# EasyEDA Pro project ProPrj_egg_2025-03-07.epro

# Schematic 功能图

## Sheets
1 P1: Board Name: Board1; Create Date: 2025-02-22; Page Name: P1; Project Name: egg; Schematic Name: 功能图; Update Date: 2025-03-04; Company: 嘉立创EDA; Page Size: A4; Version: V1.0
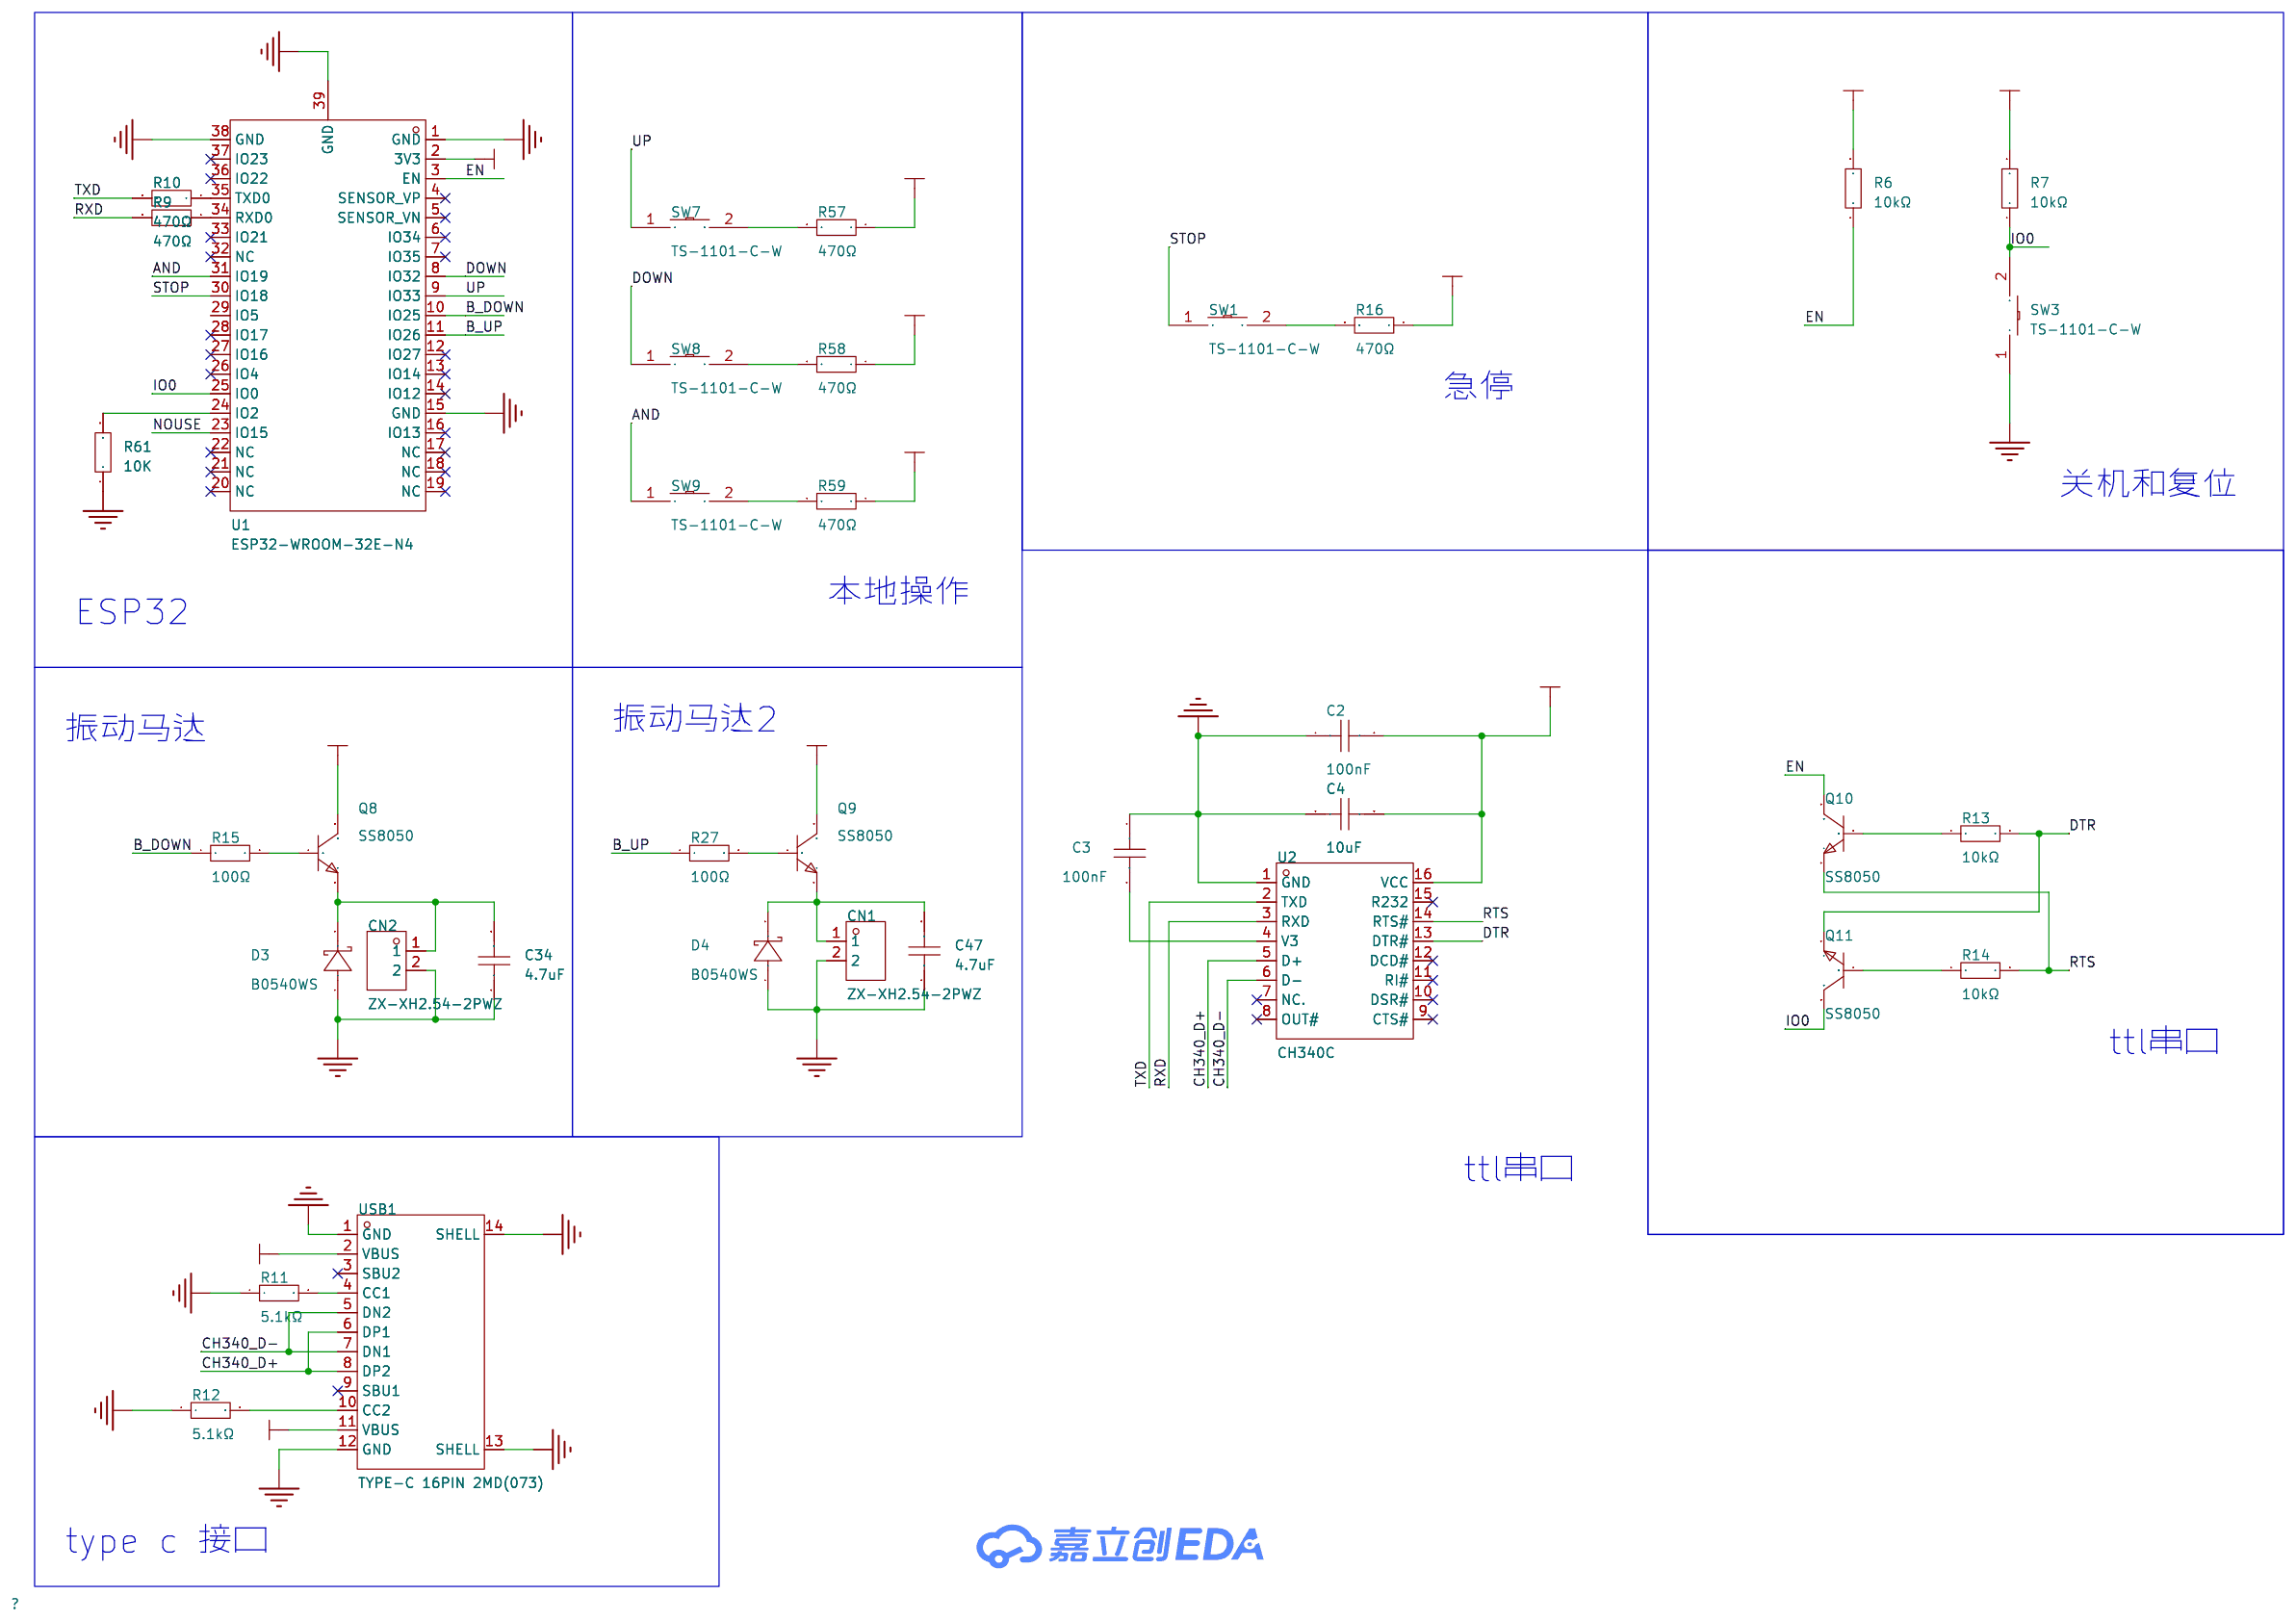
[diagram p0: P1]
2 P2: Create Date: 2025-02-26; Page Name: P2; Update Date: 2025-03-03
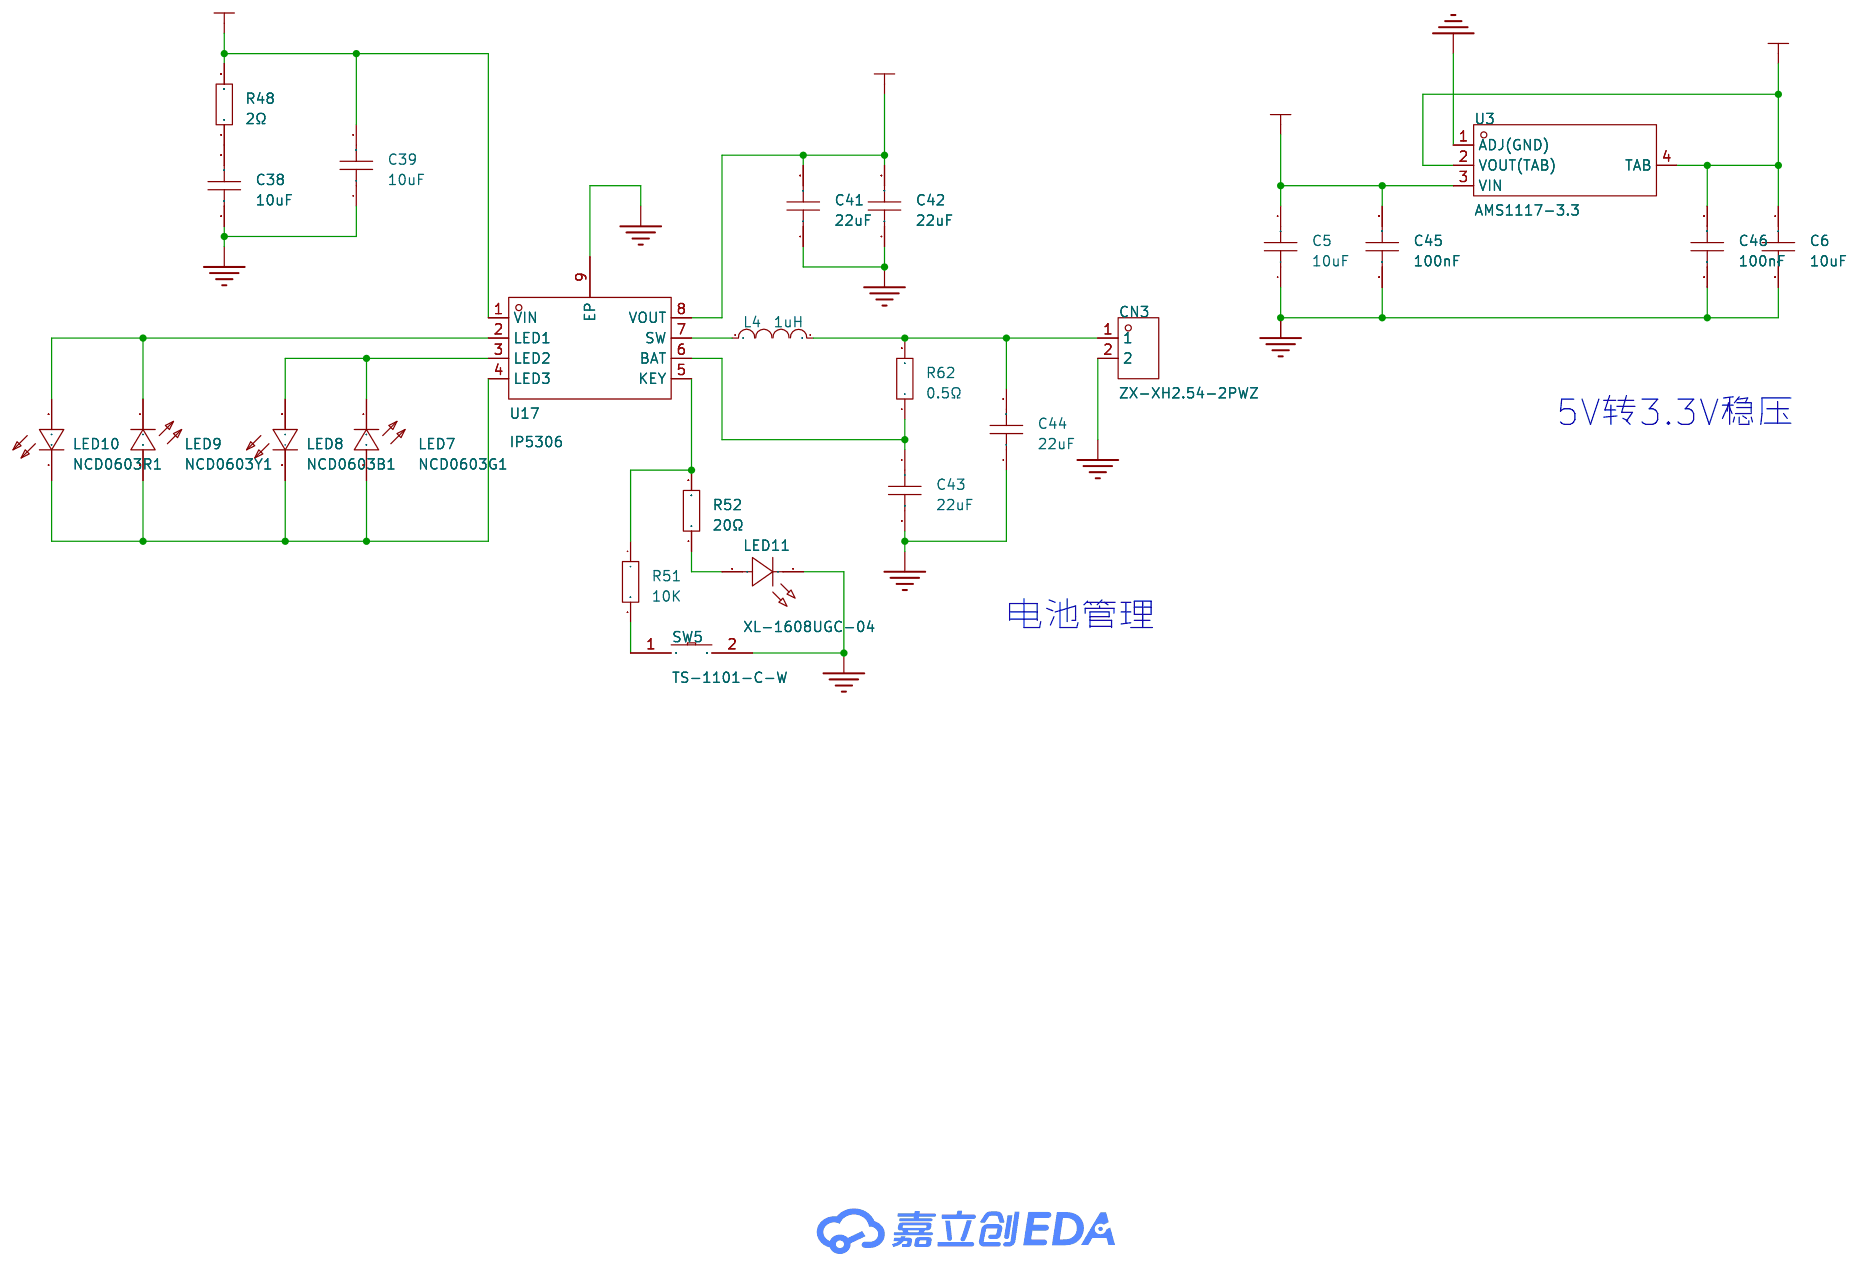
[diagram p1: P2]

## Parts
sheet P1
C2  100nF  [C0603]
C3  100nF  [C0603]
C4  10uF  [C0603]
C34  4.7uF  [C0603]
C47  4.7uF  [C0603]
CN1  ZX-XH2.54-2PWZ  [CONN-TH_2P-P2.50_ZX-XH2.54-2PWZ]
CN2  ZX-XH2.54-2PWZ  [CONN-TH_2P-P2.50_ZX-XH2.54-2PWZ]
D3  B0540WS  [SOD-323_L1.7-W1.3-LS2.5-FD]
D4  B0540WS  [SOD-323_L1.7-W1.3-LS2.5-FD]
Q8  SS8050  [SOT-23-3_L2.9-W1.3-P1.90-LS2.4-BR]
Q9  SS8050  [SOT-23-3_L2.9-W1.3-P1.90-LS2.4-BR]
Q10  SS8050  [SOT-23-3_L2.9-W1.3-P1.90-LS2.4-BR]
Q11  SS8050  [SOT-23-3_L2.9-W1.3-P1.90-LS2.4-BR]
R6  10kΩ  [R0603]
R7  10kΩ  [R0603]
R9  470Ω  [R0603]
R10  470Ω  [R0603]
R11  5.1kΩ  [R0603]
R12  5.1kΩ  [R0603]
R13  10kΩ  [R0603]
R14  10kΩ  [R0603]
R15  100Ω  [R0603]
R16  470Ω  [R0603]
R27  100Ω  [R0603]
R57  470Ω  [R0603]
R58  470Ω  [R0603]
R59  470Ω  [R0603]
R61  10K  [R0603]
SW1  TS-1101-C-W  [SW-SMD_L6.0-W3.3-LS8.0]
SW3  TS-1101-C-W  [SW-SMD_L6.0-W3.3-LS8.0]
SW7  TS-1101-C-W  [SW-SMD_L6.0-W3.3-LS8.0]
SW8  TS-1101-C-W  [SW-SMD_L6.0-W3.3-LS8.0]
SW9  TS-1101-C-W  [SW-SMD_L6.0-W3.3-LS8.0]
U1  ESP32-WROOM-32E-N4  [WIFI-SMD_ESP32-WROOM-32E]
U2  CH340C  [SOP-16_L10.0-W3.9-P1.27-LS6.0-BL]
USB1  TYPE-C 16PIN 2MD(073)  [USB-C-SMD_TYPE-C-6PIN-2MD-073]
sheet P2
C5  10uF  [C0603]
C6  10uF  [C0603]
C38  10uF  [C0603]
C39  10uF  [C0603]
C41  22uF  [C0603]
C42  22uF  [C0603]
C43  22uF  [C0603]
C44  22uF  [C0603]
C45  100nF  [C0603]
C46  100nF  [C0603]
CN3  ZX-XH2.54-2PWZ  [CONN-TH_2P-P2.50_ZX-XH2.54-2PWZ]
L4  1uH  [L0603]
LED7  NCD0603G1  [LED0603-RD_1]
LED8  NCD0603B1  [LED0603-RD]
LED9  NCD0603Y1  [LED0603-RD]
LED10  NCD0603R1  [LED0603-RD_RED]
LED11  XL-1608UGC-04  [LED0603-RD_GREEN]
R48  2Ω  [R0603]
R51  10K  [R0603]
R52  20Ω  [R0603]
R62  0.5Ω  [R0603]
SW5  TS-1101-C-W  [SW-SMD_L6.0-W3.3-LS8.0]
U3  AMS1117-3.3  [SOT-223-4_L6.5-W3.5-P2.30-LS7.0-BR]
U17  IP5306  [ESOP-8_L4.9-W3.9-P1.27-LS6.0-BL-EP]

## Library data of the parts
C2 C3 = CGA0603X7R104K500JT: 容值:100nF;精度:±10%;额定电压:50V;材质(温度系数):X7R;; LCSC Part Name: 100nF ±10% 50V; Supplier Part: C6119867; Manufacturer: HRE(芯声); Supplier Footprint: 0603; JLCPCB Part Class: 扩展库; Supplier: LCSC; Tolerance: ±10%; Voltage Rated: 50V; Temperature Coefficient: X7R
C4-C6 = CGA0603X5R106K100JT: 容值:10uF;精度:±10%;额定电压:10V;材质(温度系数):X5R;; LCSC Part Name: 10uF ±10% 10V; Supplier Part: C6119842; Manufacturer: HRE(芯声); Supplier Footprint: 0603; JLCPCB Part Class: 扩展库; Supplier: LCSC; Tolerance: ±10%; Voltage Rated: 10V; Temperature Coefficient: X5R
C34 C38 C39 C41-C47 = CAP_0603: Supplier Footprint: 0603
CN1-CN3 = ZX-XH2.54-2PWZ: 插针结构:1x2P;间距:2.5mm;安装方式:弯插;参考系列:XH;总PIN数:2P;排数:1;每排PIN数:2;行距:-;额定电流:3A;触头材质:黄铜;触头镀层:锡;工作温度范围:-25℃~+85℃;; LCSC Part Name: 1x2P 间距:2.5mm 弯插 系列:XH; Supplier Part: C7429641; Manufacturer: Megastar(兆星); Supplier Footprint: 弯插,P=2.5mm; JLCPCB Part Class: 扩展库; Datasheet: https://atta.szlcsc.com/upload/public/pdf/source/20230619/56AE8F2E01CDFEAA97FC89B5ED558AB5.pdf; Supplier: LCSC; Pins Structure: 1x2P; Pitch: 2.5mm; Mounting Type: 弯插; Reference Series: XH; Number of Pins: 2P; Number of Rows: 1; Number of PINs Per Row: 2; Rated Current: 3A; Contact Material: 黄铜; Contact Plating: 锡; Operating Temperature: -25℃~+85℃; Rated Voltage (Max): 250V; Plastic Material: PA66; Flame Retardant Rating: UL94V-0; Color: 白色; Z-Height of the Board: 5.9mm; X-Length of Bottom Edge on Board (Spacing Line): 7.5mm; Y-Width of Bottom Edge on Board: 7.32mm
D3 D4 = B0540WS_C7420326: 二极管配置:独立式;正向压降(Vf):510mV@500mA;直流反向耐压(Vr):40V;整流电流:500mA;; LCSC Part Name: 电压:40V 电流:500mA; Supplier Part: C7420326; Manufacturer: 宏迦橙; Supplier Footprint: SOD-323; JLCPCB Part Class: 扩展库; Datasheet: https://atta.szlcsc.com/upload/public/pdf/source/20230828/D03BBC301FC735629C9CE389FB922DA4.pdf; Supplier: LCSC; Diode Configuration: 独立式; Forward Voltage (Vf@If): 510mV@500mA; Reverse Voltage (Vr): 40V; Rectified Current: 500mA; Reverse Leakage Current (Ir): 20uA@40V
Q8-Q11 = SS8050_C7420370: 晶体管类型:NPN;集电极电流(Ic):1.5A;集射极击穿电压(Vceo):25V;耗散功率(Pd):300mW;直流电流增益(hFE):120@100mA,1.0V;; LCSC Part Name: H档 200-350; Supplier Part: C7420370; Manufacturer: 宏嘉诚; Supplier Footprint: SOT-23; JLCPCB Part Class: 扩展库; Datasheet: https://atta.szlcsc.com/upload/public/pdf/source/20250205/5DB94E86981B5B1A1866D18E379C0D4F.pdf; Supplier: LCSC; type: NPN; Current - Collector(Ic): 1.5A; Collector - Emitter Voltage VCEO: 25V; Pd - Power Dissipation: 300mW; DC Current Gain: 120@100mA,1.0V; Transition frequency(fT): 100MHz; Current - Collector Cutoff: 100nA; Vce Saturation(VCE(sat)): 500mV; Operating Temperature: -55℃~+150℃
R6 R7 R11-R14 = 0603WAF1002T5E: 电阻类型:厚膜电阻;阻值:10kΩ;精度:±1%;功率:100mW;最大工作电压:75V;温度系数:±100ppm/℃;; LCSC Part Name: 厚膜电阻 10kΩ ±1% 100mW; Supplier Part: C25804; Manufacturer: UNI-ROYAL(厚声); Supplier Footprint: 0603; JLCPCB Part Class: 基础库; Datasheet: https://atta.szlcsc.com/upload/public/pdf/source/20200306/C422600_1E6D84923E4A46A82E41ADD87F860B5C.pdf; Supplier: LCSC; Type: 厚膜电阻; Tolerance: ±1%; Power(Watts): 100mW; Overload Voltage (Max): 75V; Temperature Coefficient: ±100ppm/℃; Operating Temperature Range: -55℃~+155℃
R9 R10 R16 R57-R59 = 0603WAF4700T5E: 电阻类型:厚膜电阻;阻值:470Ω;精度:±1%;功率:100mW;最大工作电压:75V;温度系数:±100ppm/℃;; LCSC Part Name: 470Ω ±1% 100mW 厚膜电阻; Supplier Part: C23179; Manufacturer: UNI-ROYAL(厚声); Supplier Footprint: 0603; JLCPCB Part Class: 基础库; Datasheet: https://atta.szlcsc.com/upload/public/pdf/source/20200306/C422600_1E6D84923E4A46A82E41ADD87F860B5C.pdf; Supplier: LCSC; Type: 厚膜电阻; Tolerance: ±1%; Power(Watts): 100mW; Overload Voltage (Max): 75V; Temperature Coefficient: ±100ppm/℃; Operating Temperature Range: -55℃~+155℃
R15 R27 R48 R51 R52 R61 R62 = Res_0603: Supplier Footprint: 0603
SW1 SW3 SW5 SW7-SW9 = TS-1101-C-W: 电路结构:单刀单掷;按钮形状:矩形按钮;作用力:260gf;安装方式:立贴;开关长度:6mm;开关宽度:3.6mm;开关高度:2.5mm;带支架:不带;触点电流:50mA;额定电压(AC):-;额定电压(DC):12V;额定功率:-;绝缘电阻:-;带灯:无;机械寿命:5万次;; LCSC Part Name: 6*3.6*2.5mm 立贴 轻触开关; Supplier Part: C318938; Manufacturer: XKB Connectivity(中国星坤); Supplier Footprint: SMD; JLCPCB Part Class: 扩展库; Datasheet: https://atta.szlcsc.com/upload/public/pdf/source/20200227/C318938_C2E53B1EEDE37D980A33616AC086DE53.pdf; Supplier: LCSC; Circuit: 单刀单掷; Actuator Style: 矩形按钮; Operating Force: 260gf; Mounting Style: 立贴; Switch Length: 6mm; Switch Width: 3.6mm; Switch Height: 2.5mm; Strike Gundam: 不带; Contact Current: 50mA; Voltage Rating (DC): 12V; Actuator/Cap Color: 白色带淡绿; With Lamp: 无; Mechanical Life: 5万次; Operating Temperature: -30℃~+85℃
U1 = ESP32-WROOM-32E-N4: ESP32-WROOM-32E 集成 ESP32-D0WD-V3 芯片，具有高的稳定性和安全性能。; LCSC Part Name: 通用型Wi-Fi+BT+BLE MCU模组; Supplier Part: C701341; Manufacturer: ESPRESSIF(乐鑫); Supplier Footprint: SMD,18x25.5mm; JLCPCB Part Class: 扩展库; Datasheet: https://atta.szlcsc.com/upload/public/pdf/source/20220601/0020821B65DE5740BBACA5FACC5CF3B6.pdf; Supplier: LCSC
U2 = CH340C: 应用功能:收发器;接口协议:USB 2.0;数据速率:2Mbps;; LCSC Part Name: CH340C USB转串口芯片 CH340; Supplier Part: C84681; Manufacturer: WCH(南京沁恒); Supplier Footprint: SOP-16; JLCPCB Part Class: 扩展库; Datasheet: https://atta.szlcsc.com/upload/public/pdf/source/20240619/63986D8440D4E5267A77ACD891CC4DE3.pdf; Supplier: LCSC; Applications Function: 收发器; Protocol: USB 2.0; Supply Voltage: 3.3V；5V; Data Rate: 2Mbps
USB1 = TYPE-C 16PIN 2MD(073): 连接器类型:Type-C;标准:USB 3.1;公母:母;安装方式:卧贴;触点数量:16P;端口数量:1;额定电流 - 电源:5A;工作温度范围:-25℃~+85℃;; LCSC Part Name: Type-C 母 卧贴; Supplier Part: C2765186; Manufacturer: SHOU HAN(首韩); Supplier Footprint: SMD; JLCPCB Part Class: 扩展库; Datasheet: https://atta.szlcsc.com/upload/public/pdf/source/20211123/39B17C16241EAC15C5E277BDA434118E.pdf; Supplier: LCSC; Connector Type: Type-C; Standard: USB 3.1; Gender: 母; Mounting Style: 卧贴; Number of Contacts: 16P; Number of Ports: 1; Current Rating - Power (Max): 5A; Operating Temperature Range: -25℃~+85℃; Rated Voltage (Max): 5V; Connect-Disconnect Life: 5千次; Core Colour: 黑色
L4 = L_0603
LED7 = NCD0603G1: 发光颜色:翠绿色;正向电压(VF):2.6V~3.6V;功率:72mW;正向电流:10mA;主波长:515nm~530nm;透镜颜色:无色透明透镜;发光强度:330mcd~900mcd;发光角度:130°;工作温度:-30℃~+85℃;; Supplier Part: C84267; Manufacturer: 国星光电; Supplier Footprint: 0603; JLCPCB Part Class: 扩展库; Datasheet: https://atta.szlcsc.com/upload/public/pdf/source/20200820/C84267_04BA7703640BAC111D09F5EFB971FBF3.pdf; Supplier: LCSC; Emitted Color: 翠绿色; Forward Voltage (VF): 2.6V~3.6V; Power Dissipation: 72mW; Forward Current: 10mA; Dominant Wavelength: 515nm~530nm; Lens Color: 无色透明透镜; Luminous Intensity: 330mcd~900mcd; Viewing Angle: 130°; Operating Temperature: -30℃~+85℃
LED8 = NCD0603B1: 发光颜色:蓝色;正向电压(VF):2.6V~3.6V;功率:72mW;正向电流:10mA;主波长:463nm~475nm;透镜颜色:无色透明透镜;发光强度:80mcd~220mcd;发光角度:130°;工作温度:-30℃~+85℃;; Supplier Part: C84266; Manufacturer: 国星光电; Supplier Footprint: 0603; JLCPCB Part Class: 扩展库; Datasheet: https://atta.szlcsc.com/upload/public/pdf/source/20200820/C84266_6A3CDBEFA72C6CAD68EDA53474ADAE6C.pdf; Supplier: LCSC; Emitted Color: 蓝色; Forward Voltage (VF): 2.6V~3.6V; Power Dissipation: 72mW; Forward Current: 10mA; Dominant Wavelength: 463nm~475nm; Lens Color: 无色透明透镜; Luminous Intensity: 80mcd~220mcd; Viewing Angle: 130°; Operating Temperature: -30℃~+85℃
LED9 = NCD0603Y1: 发光颜色:黄色;正向电压(VF):1.6V~2.6V;功率:65mW;正向电流:20mA;主波长:586nm~595nm;透镜颜色:无色透明透镜;发光强度:80mcd~220mcd;发光角度:130°;工作温度:-30℃~+85℃;; Supplier Part: C84268; Manufacturer: 国星光电; Supplier Footprint: 0603; JLCPCB Part Class: 扩展库; Datasheet: https://atta.szlcsc.com/upload/public/pdf/source/20200820/C84268_8FC106CB292CF978F9CFC6892464F83C.pdf; Supplier: LCSC; Emitted Color: 黄色; Forward Voltage (VF): 1.6V~2.6V; Power Dissipation: 65mW; Forward Current: 20mA; Dominant Wavelength: 586nm~595nm; Lens Color: 无色透明透镜; Luminous Intensity: 80mcd~220mcd; Viewing Angle: 130°; Operating Temperature: -30℃~+85℃
LED10 = NCD0603R1_C84263: 灯头类型:-;发光颜色:红色;正向电压(VF):1.6V~2.6V;功率:65mW;正向电流:20mA;主波长:615nm~630nm;二极管配置:独立二极管;透镜颜色:无色透明透镜;色温:-;发光强度:80mcd~220mcd;发光角度:130°;载带方式:-;工作温度:-30℃~+85℃;; Supplier Part: C84263; Manufacturer: 国星光电; Supplier Footprint: 0603; JLCPCB Part Class: 扩展库; Datasheet: https://atta.szlcsc.com/upload/public/pdf/source/20200820/C84263_DABC6A75E58F576973B407FDBA283D60.pdf; Supplier: LCSC; Emitted Color: 红色; Forward Voltage (VF): 1.6V~2.6V; Power Dissipation: 65mW; Forward Current: 20mA; Dominant Wavelength: 615nm~630nm; Diode Configuration: 独立二极管; Lens Color: 无色透明透镜; Luminous Intensity: 80mcd~220mcd; Viewing Angle: 130°; Operating Temperature: -30℃~+85℃
LED11 = XL-1608UGC-04: 灯头类型:-;发光颜色:翠绿色;正向电压(VF):-;功率:80mW;正向电流:25mA;主波长:516nm~525nm;二极管配置:独立二极管;透镜颜色:无色透明透镜;色温:-;发光强度:-;发光角度:120°;载带方式:正贴;工作温度:-30℃~+85℃;; Supplier Part: C965804; Manufacturer: XINGLIGHT(成兴光); Supplier Footprint: 0603; JLCPCB Part Class: 扩展库; Datasheet: https://atta.szlcsc.com/upload/public/pdf/source/20221102/520D6E465E5CFD1609C8A4DBC80D4018.pdf; Supplier: LCSC; Emitted Color: 翠绿色; Power Dissipation: 80mW; Forward Current: 25mA; Dominant Wavelength: 516nm~525nm; Peak Wavelength: 534nm; Diode Configuration: 独立二极管; Lens Color: 无色透明透镜; Viewing Angle: 120°; Mounting Sytle: 正贴; Operating Temperature: -30℃~+85℃
U3 = AMS1117-3.3_C347222: 输出类型:固定;工作电压:12V;输出电压:3.3V;输出电流:1A;电源纹波抑制比(PSRR):60dB@(120Hz);输出极性:正极;; LCSC Part Name: 输出:3.3V 电流:1A 耐压:12V; Supplier Part: C347222; Manufacturer: UMW(友台半导体); Supplier Footprint: SOT-223; JLCPCB Part Class: 扩展库; Datasheet: https://atta.szlcsc.com/upload/public/pdf/source/20241218/BAF0263FA2E44BCD8AF41AA4FA04EFAA.pdf; Supplier: LCSC; Output Type: 固定; Maximum Input Voltage: 12V; Output Voltage: 3.3V; Output Current: 1A; Power Supply Rejection Ratio (PSRR): 60dB@(120Hz); Dropout Voltage: 1.3V@(1A); Feature: 过流保护(OCP); Output Polarity: 正极; Number of Outputs: 1
U17 = IP5306: 2.1A充电2.4A放电高集成度移动电源SOC; Supplier Part: C181692; Manufacturer: INJOINIC(英集芯); Supplier Footprint: ESOP-8; JLCPCB Part Class: 扩展库; Datasheet: https://atta.szlcsc.com/upload/public/pdf/source/20190627/C384572_9925B3DDC4041BC6108E5AB46A2A0AB1.pdf; Supplier: LCSC

## Nets
3.3V: C6.1 C46.2 Q9.3(C) R6.2 R7.2 R16.1 R57.1 R58.1 R59.1 U1.2(3V3) U3.2(VOUT(TAB)) U3.4(TAB)
5V: C5.2 C41.2 C42.2 C45.2 Q8.3(C) U3.3(VIN) U17.8(VOUT)
GND: C2.1 C3.1 C4.1 C5.1 C6.2 C34.1 C38.1 C39.1 C41.1 C42.1 C43.2 C44.1 C45.1 C46.1 C47.1 CN1.2 CN2.2 CN3.2 D3.1(A) D4.1(A) LED11.1(K) R11.1 R12.1 R61.1 SW3.1 SW5.2 U1.1(GND) U1.15(GND) U1.38(GND) U1.39(GND) U2.1(GND) U3.1(ADJ(GND)) U17.9(EP) USB1.1(GND) USB1.12(GND) USB1.13(SHELL) USB1.14(SHELL)
VBUS: C2.2 C4.2 C39.2 R48.2 U2.16(VCC) U17.1(VIN) USB1.2(VBUS) USB1.11(VBUS)
AND: SW9.1 U1.31(IO19)
B_DOWN: R15.1 U1.10(IO25)
B_UP: R27.1 U1.11(IO26)
CH340_D+: U2.5(D+) USB1.6(DP1) USB1.8(DP2)
CH340_D-: U2.6(D-) USB1.5(DN2) USB1.7(DN1)
DOWN: SW8.1 U1.8(IO32)
DTR: Q11.2(E) R13.2 U2.13(DTR#)
EN: Q10.3(C) R6.1 U1.3(EN)
IO0: Q11.3(C) R7.1 SW3.2 U1.25(IO0)
NOUSE: U1.23(IO15)
RTS: Q10.2(E) R14.2 U2.14(RTS#)
RXD: R9.2 U2.3(RXD)
STOP: SW1.1 U1.30(IO18)
TXD: R10.2 U2.2(TXD)
UP: SW7.1 U1.9(IO33)
$1N2030: R10.1 U1.35(TXD0)
$1N2036: R9.1 U1.34(RXD0)
$1N2231: C3.2 U2.4(V3)
$1N2993: R11.2 USB1.4(CC1)
$1N3161: R12.2 USB1.10(CC2)
$1N3457: Q10.1(B) R13.1
$1N3461: Q11.1(B) R14.1
$1N3836: Q8.1(B) R15.2
$1N4056: R16.2 SW1.2
$1N5469: Q9.1(B) R27.2
$1N5472: C47.2 CN1.1 D4.2(K) Q9.2(E)
$1N8409: R57.2 SW7.2
$1N8413: R58.2 SW8.2
$1N8417: R59.2 SW9.2
$1N8861: R61.2 U1.24(IO2)
$1N9302: C34.2 CN2.1 D3.2(K) Q8.2(E)
$2N7089: C38.2 R48.1
$2N7648: L4.1 U17.7(SW)
$2N7999: R51.1 R52.2 U17.5(KEY)
$2N8119: R51.2 SW5.1
$2N8284: LED11.2(A) R52.1
$2N8838: C43.1 R62.1 U17.6(BAT)
$2N8868: C44.2 CN3.1 L4.2 R62.2
$2N9076: LED7.2(A) LED8.1(-) LED9.2(A) LED10.1(K) U17.4(LED3)
$2N9082: LED7.1(K) LED8.2(+) U17.3(LED2)
$2N9123: LED9.1(K) LED10.2(A) U17.2(LED1)

Not connected (* = marked no-connect by the designer): U1 4(SENSOR_VP)* 5(SENSOR_VN)* 6(IO34)* 7(IO35)* 12(IO27)* 13(IO14)* 14(IO12)* 16(IO13)* 17(NC)* 18(NC)* 19(NC)* 20(NC)* 21(NC)* 22(NC)* 26(IO4)* 27(IO16)* 28(IO17)* 29(IO5) 32(NC)* 33(IO21)* 36(IO22)* 37(IO23)*; U2 7(NC.)* 8(OUT#)* 9(CTS#)* 10(DSR#)* 11(RI#)* 12(DCD#)* 15(R232)*; USB1 3(SBU2)* 9(SBU1)*

## Notes on the sheets
sheet 1
- 急停
- 关机和复位
- 本地操作
- ESP32
- 振动马达2
- 振动马达
- ttl串口
- ttl串口
- type c 接口
sheet 2
- 5V转3.3V稳压
- 电池管理

# Schematic 连接图

## Sheets
1 P1: Create Date: 2025-03-02; Page Name: P1; Project Name: egg; Schematic Name: 连接图; Update Date: 2025-03-03; Company: 嘉立创EDA; Page Size: A4; Version: V1.0
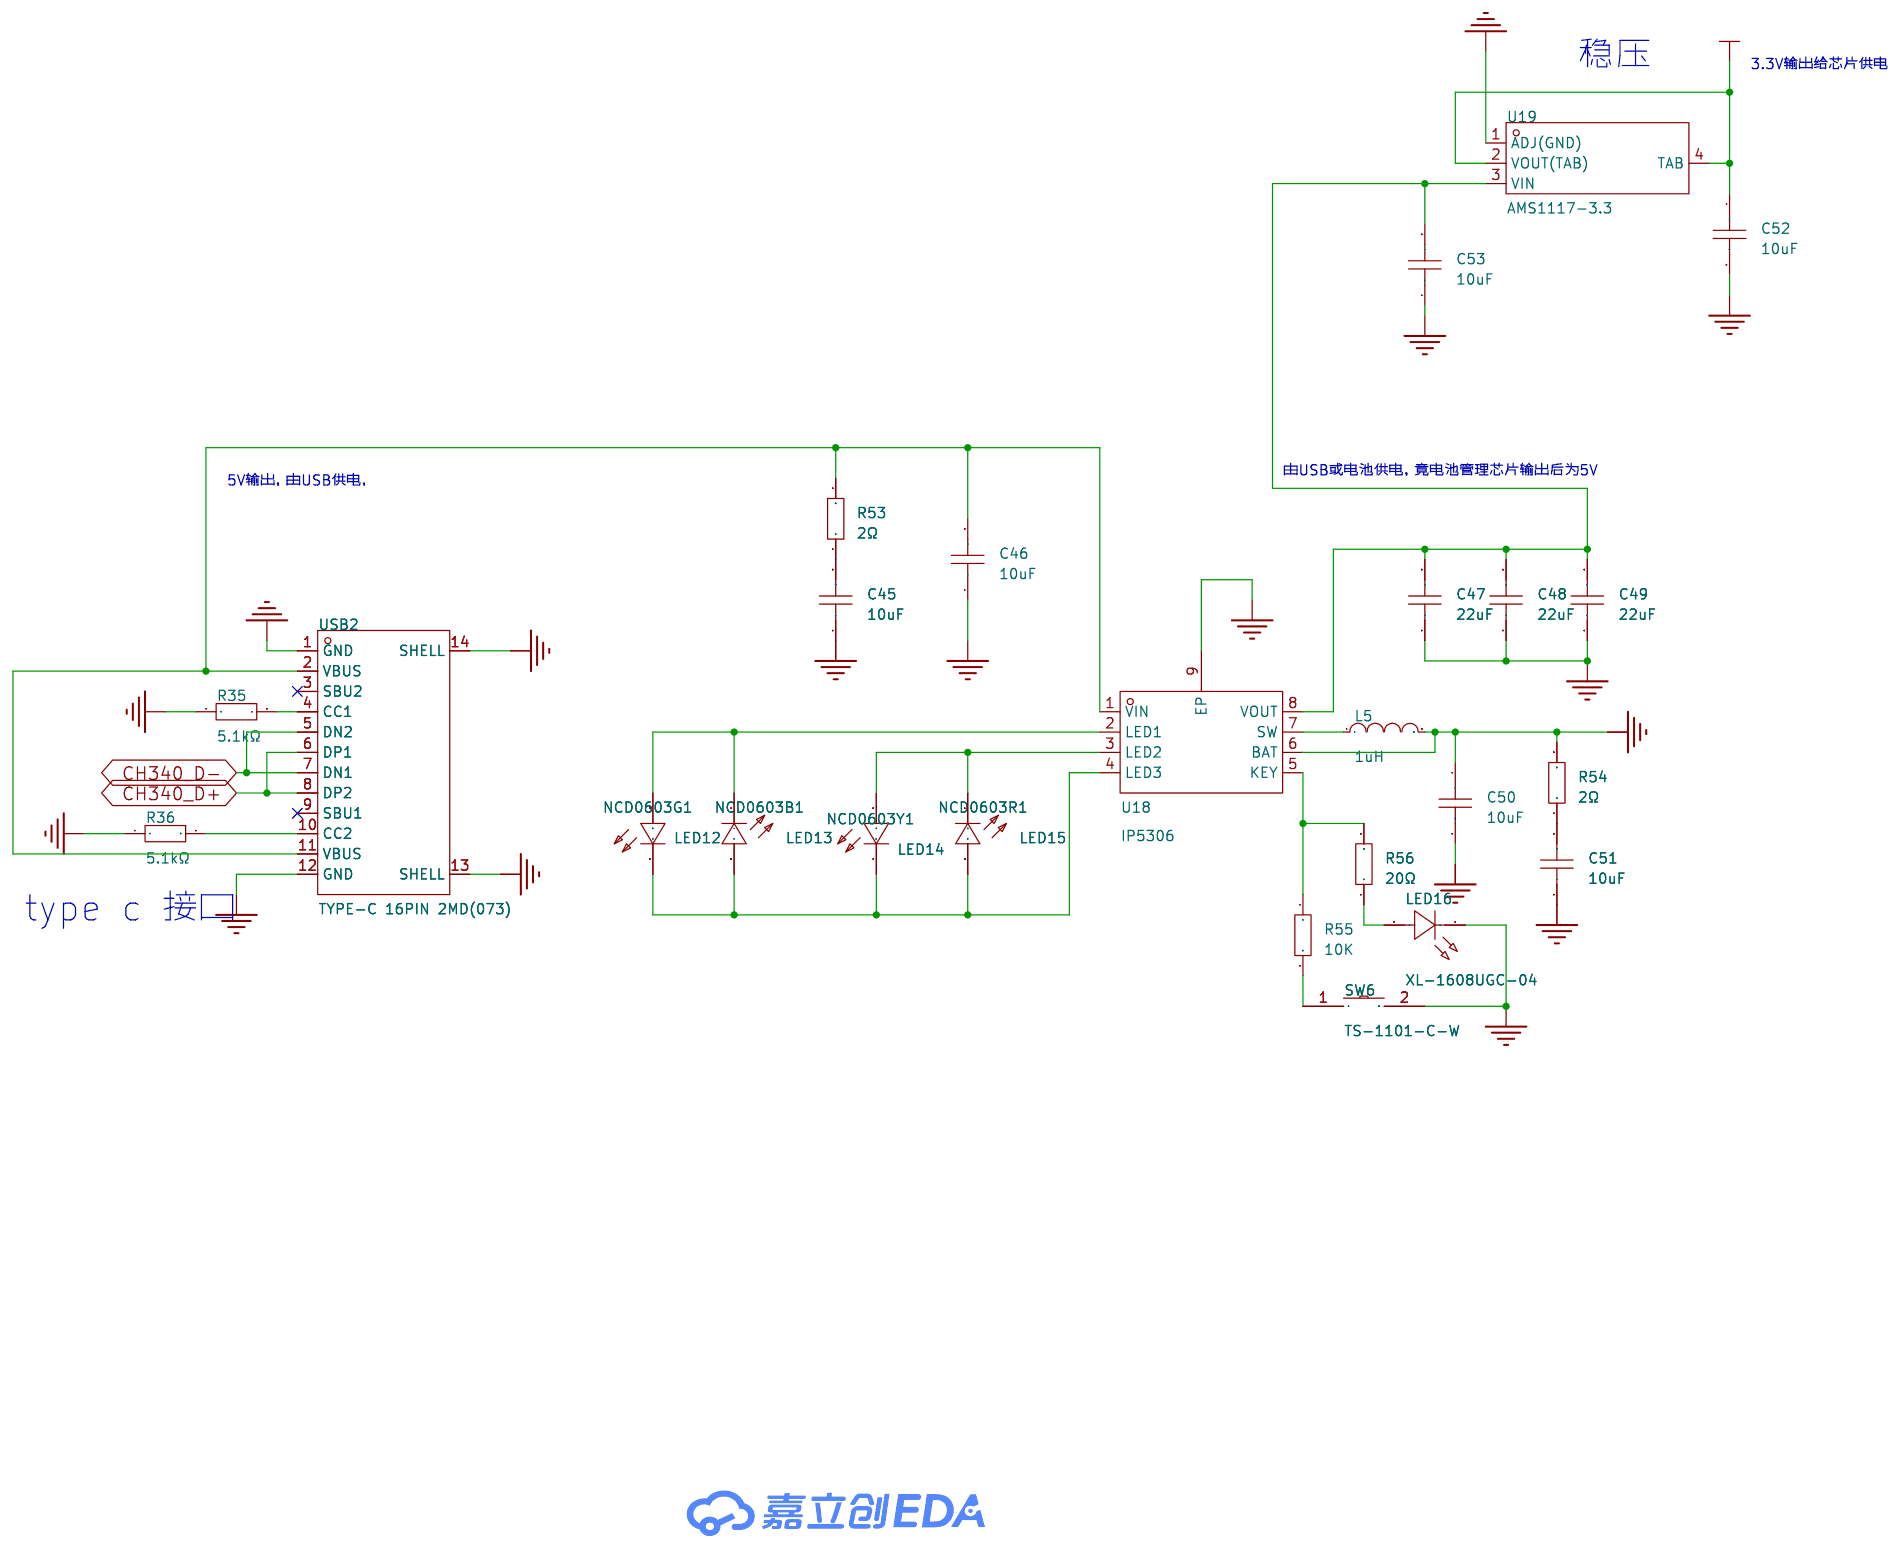
[diagram p2: P1]
2 P2: Page Name: P2
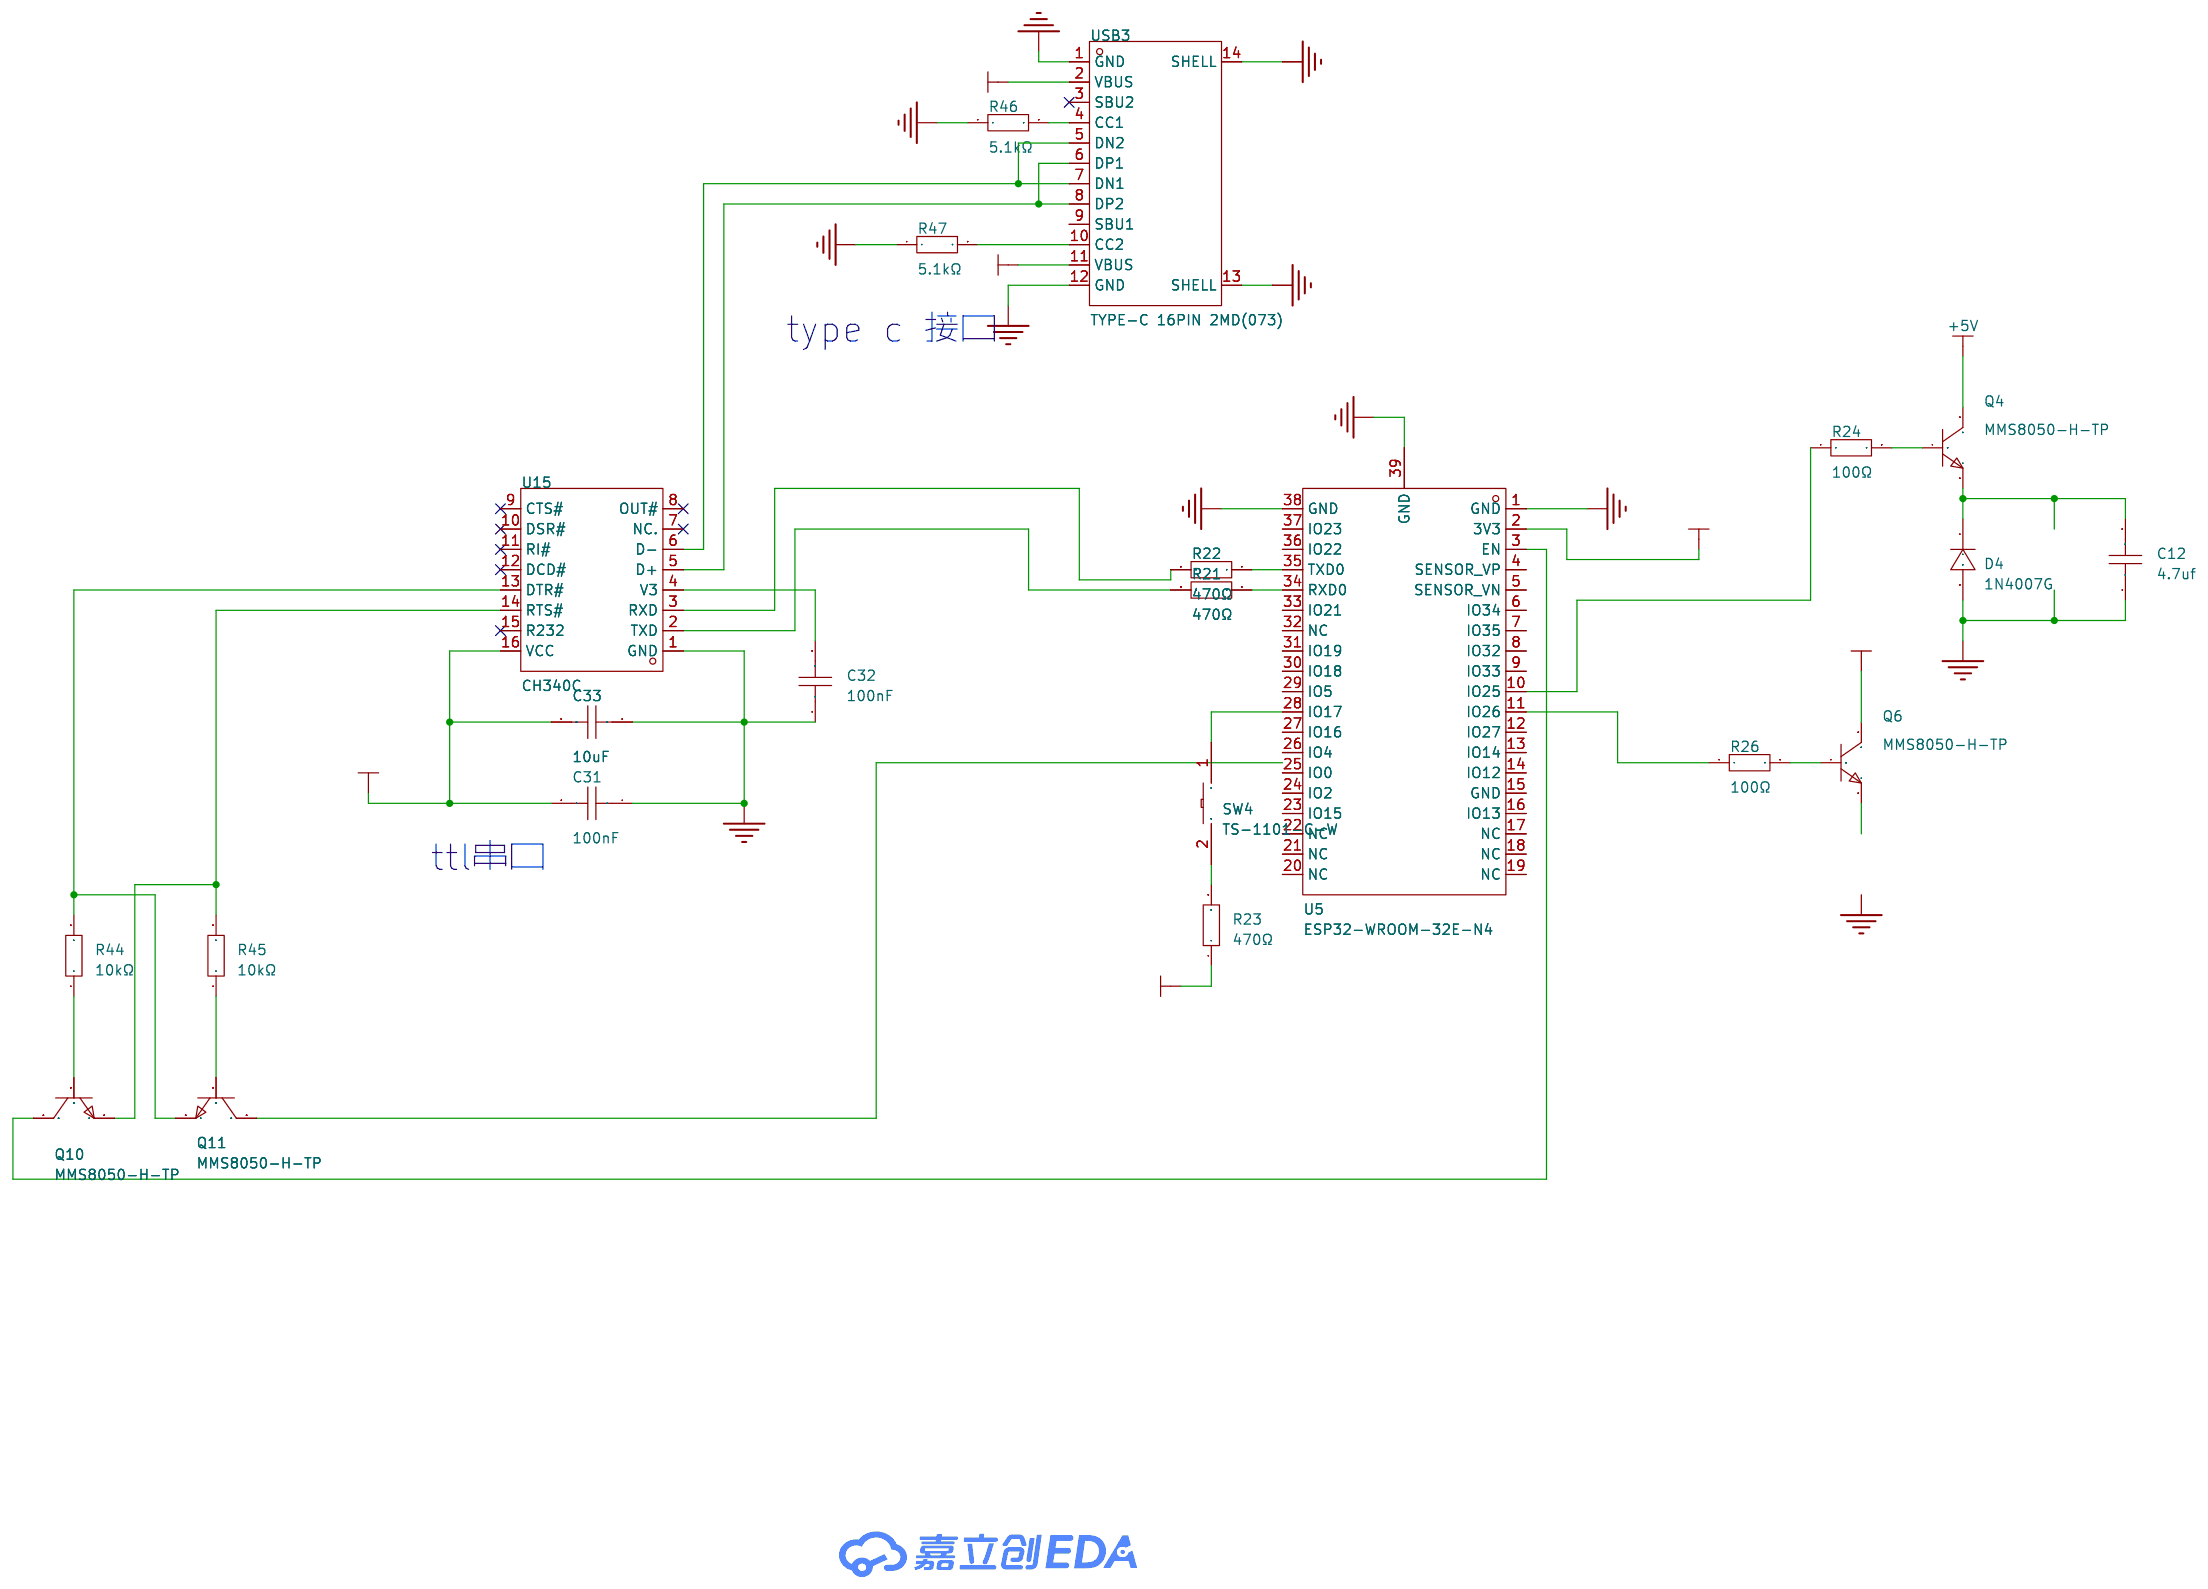
[diagram p3: P2]

## Parts
sheet P1
C45  10uF  [C0603]
C46  10uF  [C0603]
C47  22uF  [C0603]
C48  22uF  [C0603]
C49  22uF  [C0603]
C50  10uF  [C0603]
C51  10uF  [C0603]
C52  10uF  [C0603]
C53  10uF  [C0603]
L5  1uH  [L0603]
LED12  NCD0603G1  [LED0603-RD_1]
LED13  NCD0603B1  [LED0603-RD]
LED14  NCD0603Y1  [LED0603-RD]
LED15  NCD0603R1  [LED0603-RD_RED]
LED16  XL-1608UGC-04  [LED0603-RD_GREEN]
R35  5.1kΩ  [R0603]
R36  5.1kΩ  [R0603]
R53  2Ω  [R0603]
R54  2Ω  [R0603]
R55  10K  [R0603]
R56  20Ω  [R0603]
SW6  TS-1101-C-W  [SW-SMD_L6.0-W3.3-LS8.0]
U18  IP5306  [ESOP-8_L4.9-W3.9-P1.27-LS6.0-BL-EP]
U19  AMS1117-3.3  [SOT-223-4_L6.5-W3.5-P2.30-LS7.0-BR]
USB2  TYPE-C 16PIN 2MD(073)  [USB-C-SMD_TYPE-C-6PIN-2MD-073]
sheet P2
C12  4.7uf  [C0603]
C31  100nF  [C0603]
C32  100nF  [C0603]
C33  10uF  [C0603]
D4  1N4007G  [DO-41_BD2.4-L4.7-P8.70-D0.9-RD]
Q4  MMS8050-H-TP  [SOT-23-3_L2.9-W1.3-P1.90-LS2.4-BR]
Q6  MMS8050-H-TP  [SOT-23-3_L2.9-W1.3-P1.90-LS2.4-BR]
Q10  MMS8050-H-TP  [SOT-23-3_L2.9-W1.3-P1.90-LS2.4-BR]
Q11  MMS8050-H-TP  [SOT-23-3_L2.9-W1.3-P1.90-LS2.4-BR]
R21  470Ω  [R0603]
R22  470Ω  [R0603]
R23  470Ω  [R0603]
R24  100Ω  [R0603]
R26  100Ω  [R0603]
R44  10kΩ  [R0603]
R45  10kΩ  [R0603]
R46  5.1kΩ  [R0603]
R47  5.1kΩ  [R0603]
SW4  TS-1101-C-W  [SW-SMD_L6.0-W3.3-LS8.0]
U5  ESP32-WROOM-32E-N4  [WIFI-SMD_ESP32-WROOM-32E]
U15  CH340C  [SOP-16_L10.0-W3.9-P1.27-LS6.0-BL]
USB3  TYPE-C 16PIN 2MD(073)  [USB-C-SMD_TYPE-C-6PIN-2MD-073]

## Library data of the parts
C12 C45-C51 = CAP_0603: Supplier Footprint: 0603
C33 C52 C53 = CGA0603X5R106K100JT: 容值:10uF;精度:±10%;额定电压:10V;材质(温度系数):X5R;; LCSC Part Name: 10uF ±10% 10V; Supplier Part: C6119842; Manufacturer: HRE(芯声); Supplier Footprint: 0603; JLCPCB Part Class: 扩展库; Supplier: LCSC; Tolerance: ±10%; Voltage Rated: 10V; Temperature Coefficient: X5R
L5 = L_0603
LED12 = NCD0603G1: 发光颜色:翠绿色;正向电压(VF):2.6V~3.6V;功率:72mW;正向电流:10mA;主波长:515nm~530nm;透镜颜色:无色透明透镜;发光强度:330mcd~900mcd;发光角度:130°;工作温度:-30℃~+85℃;; Supplier Part: C84267; Manufacturer: 国星光电; Supplier Footprint: 0603; JLCPCB Part Class: 扩展库; Datasheet: https://atta.szlcsc.com/upload/public/pdf/source/20200820/C84267_04BA7703640BAC111D09F5EFB971FBF3.pdf; Supplier: LCSC; Emitted Color: 翠绿色; Forward Voltage (VF): 2.6V~3.6V; Power Dissipation: 72mW; Forward Current: 10mA; Dominant Wavelength: 515nm~530nm; Lens Color: 无色透明透镜; Luminous Intensity: 330mcd~900mcd; Viewing Angle: 130°; Operating Temperature: -30℃~+85℃
LED13 = NCD0603B1: 发光颜色:蓝色;正向电压(VF):2.6V~3.6V;功率:72mW;正向电流:10mA;主波长:463nm~475nm;透镜颜色:无色透明透镜;发光强度:80mcd~220mcd;发光角度:130°;工作温度:-30℃~+85℃;; Supplier Part: C84266; Manufacturer: 国星光电; Supplier Footprint: 0603; JLCPCB Part Class: 扩展库; Datasheet: https://atta.szlcsc.com/upload/public/pdf/source/20200820/C84266_6A3CDBEFA72C6CAD68EDA53474ADAE6C.pdf; Supplier: LCSC; Emitted Color: 蓝色; Forward Voltage (VF): 2.6V~3.6V; Power Dissipation: 72mW; Forward Current: 10mA; Dominant Wavelength: 463nm~475nm; Lens Color: 无色透明透镜; Luminous Intensity: 80mcd~220mcd; Viewing Angle: 130°; Operating Temperature: -30℃~+85℃
LED14 = NCD0603Y1: 发光颜色:黄色;正向电压(VF):1.6V~2.6V;功率:65mW;正向电流:20mA;主波长:586nm~595nm;透镜颜色:无色透明透镜;发光强度:80mcd~220mcd;发光角度:130°;工作温度:-30℃~+85℃;; Supplier Part: C84268; Manufacturer: 国星光电; Supplier Footprint: 0603; JLCPCB Part Class: 扩展库; Datasheet: https://atta.szlcsc.com/upload/public/pdf/source/20200820/C84268_8FC106CB292CF978F9CFC6892464F83C.pdf; Supplier: LCSC; Emitted Color: 黄色; Forward Voltage (VF): 1.6V~2.6V; Power Dissipation: 65mW; Forward Current: 20mA; Dominant Wavelength: 586nm~595nm; Lens Color: 无色透明透镜; Luminous Intensity: 80mcd~220mcd; Viewing Angle: 130°; Operating Temperature: -30℃~+85℃
LED15 = NCD0603R1_C84263: 灯头类型:-;发光颜色:红色;正向电压(VF):1.6V~2.6V;功率:65mW;正向电流:20mA;主波长:615nm~630nm;二极管配置:独立二极管;透镜颜色:无色透明透镜;色温:-;发光强度:80mcd~220mcd;发光角度:130°;载带方式:-;工作温度:-30℃~+85℃;; Supplier Part: C84263; Manufacturer: 国星光电; Supplier Footprint: 0603; JLCPCB Part Class: 扩展库; Datasheet: https://atta.szlcsc.com/upload/public/pdf/source/20200820/C84263_DABC6A75E58F576973B407FDBA283D60.pdf; Supplier: LCSC; Emitted Color: 红色; Forward Voltage (VF): 1.6V~2.6V; Power Dissipation: 65mW; Forward Current: 20mA; Dominant Wavelength: 615nm~630nm; Diode Configuration: 独立二极管; Lens Color: 无色透明透镜; Luminous Intensity: 80mcd~220mcd; Viewing Angle: 130°; Operating Temperature: -30℃~+85℃
LED16 = XL-1608UGC-04: 灯头类型:-;发光颜色:翠绿色;正向电压(VF):-;功率:80mW;正向电流:25mA;主波长:516nm~525nm;二极管配置:独立二极管;透镜颜色:无色透明透镜;色温:-;发光强度:-;发光角度:120°;载带方式:正贴;工作温度:-30℃~+85℃;; Supplier Part: C965804; Manufacturer: XINGLIGHT(成兴光); Supplier Footprint: 0603; JLCPCB Part Class: 扩展库; Datasheet: https://atta.szlcsc.com/upload/public/pdf/source/20221102/520D6E465E5CFD1609C8A4DBC80D4018.pdf; Supplier: LCSC; Emitted Color: 翠绿色; Power Dissipation: 80mW; Forward Current: 25mA; Dominant Wavelength: 516nm~525nm; Peak Wavelength: 534nm; Diode Configuration: 独立二极管; Lens Color: 无色透明透镜; Viewing Angle: 120°; Mounting Sytle: 正贴; Operating Temperature: -30℃~+85℃
R35 R36 R44-R47 = 0603WAF1002T5E: 电阻类型:厚膜电阻;阻值:10kΩ;精度:±1%;功率:100mW;最大工作电压:75V;温度系数:±100ppm/℃;; LCSC Part Name: 厚膜电阻 10kΩ ±1% 100mW; Supplier Part: C25804; Manufacturer: UNI-ROYAL(厚声); Supplier Footprint: 0603; JLCPCB Part Class: 基础库; Datasheet: https://atta.szlcsc.com/upload/public/pdf/source/20200306/C422600_1E6D84923E4A46A82E41ADD87F860B5C.pdf; Supplier: LCSC; Type: 厚膜电阻; Tolerance: ±1%; Power(Watts): 100mW; Overload Voltage (Max): 75V; Temperature Coefficient: ±100ppm/℃; Operating Temperature Range: -55℃~+155℃
R24 R26 R53-R56 = Res_0603: Supplier Footprint: 0603
SW4 SW6 = TS-1101-C-W: 电路结构:单刀单掷;按钮形状:矩形按钮;作用力:260gf;安装方式:立贴;开关长度:6mm;开关宽度:3.6mm;开关高度:2.5mm;带支架:不带;触点电流:50mA;额定电压(AC):-;额定电压(DC):12V;额定功率:-;绝缘电阻:-;带灯:无;机械寿命:5万次;; LCSC Part Name: 6*3.6*2.5mm 立贴 轻触开关; Supplier Part: C318938; Manufacturer: XKB Connectivity(中国星坤); Supplier Footprint: SMD; JLCPCB Part Class: 扩展库; Datasheet: https://atta.szlcsc.com/upload/public/pdf/source/20200227/C318938_C2E53B1EEDE37D980A33616AC086DE53.pdf; Supplier: LCSC; Circuit: 单刀单掷; Actuator Style: 矩形按钮; Operating Force: 260gf; Mounting Style: 立贴; Switch Length: 6mm; Switch Width: 3.6mm; Switch Height: 2.5mm; Strike Gundam: 不带; Contact Current: 50mA; Voltage Rating (DC): 12V; Actuator/Cap Color: 白色带淡绿; With Lamp: 无; Mechanical Life: 5万次; Operating Temperature: -30℃~+85℃
U18 = IP5306: 2.1A充电2.4A放电高集成度移动电源SOC; Supplier Part: C181692; Manufacturer: INJOINIC(英集芯); Supplier Footprint: ESOP-8; JLCPCB Part Class: 扩展库; Datasheet: https://atta.szlcsc.com/upload/public/pdf/source/20190627/C384572_9925B3DDC4041BC6108E5AB46A2A0AB1.pdf; Supplier: LCSC
U19 = AMS1117-3.3_C347222: 输出类型:固定;工作电压:12V;输出电压:3.3V;输出电流:1A;电源纹波抑制比(PSRR):60dB@(120Hz);输出极性:正极;; LCSC Part Name: 输出:3.3V 电流:1A 耐压:12V; Supplier Part: C347222; Manufacturer: UMW(友台半导体); Supplier Footprint: SOT-223; JLCPCB Part Class: 扩展库; Datasheet: https://atta.szlcsc.com/upload/public/pdf/source/20241218/BAF0263FA2E44BCD8AF41AA4FA04EFAA.pdf; Supplier: LCSC; Output Type: 固定; Maximum Input Voltage: 12V; Output Voltage: 3.3V; Output Current: 1A; Power Supply Rejection Ratio (PSRR): 60dB@(120Hz); Dropout Voltage: 1.3V@(1A); Feature: 过流保护(OCP); Output Polarity: 正极; Number of Outputs: 1
USB2 USB3 = TYPE-C 16PIN 2MD(073): 连接器类型:Type-C;标准:USB 3.1;公母:母;安装方式:卧贴;触点数量:16P;端口数量:1;额定电流 - 电源:5A;工作温度范围:-25℃~+85℃;; LCSC Part Name: Type-C 母 卧贴; Supplier Part: C2765186; Manufacturer: SHOU HAN(首韩); Supplier Footprint: SMD; JLCPCB Part Class: 扩展库; Datasheet: https://atta.szlcsc.com/upload/public/pdf/source/20211123/39B17C16241EAC15C5E277BDA434118E.pdf; Supplier: LCSC; Connector Type: Type-C; Standard: USB 3.1; Gender: 母; Mounting Style: 卧贴; Number of Contacts: 16P; Number of Ports: 1; Current Rating - Power (Max): 5A; Operating Temperature Range: -25℃~+85℃; Rated Voltage (Max): 5V; Connect-Disconnect Life: 5千次; Core Colour: 黑色
C31 C32 = CGA0603X7R104K500JT: 容值:100nF;精度:±10%;额定电压:50V;材质(温度系数):X7R;; LCSC Part Name: 100nF ±10% 50V; Supplier Part: C6119867; Manufacturer: HRE(芯声); Supplier Footprint: 0603; JLCPCB Part Class: 扩展库; Supplier: LCSC; Tolerance: ±10%; Voltage Rated: 50V; Temperature Coefficient: X7R
D4 = 1N4007G_C232439: 二极管配置:-;正向压降(Vf):930mV@1A;直流反向耐压(Vr):1kV;整流电流:1A;; LCSC Part Name: 电压:1kV 电流:1A; Supplier Part: C232439; Manufacturer: onsemi(安森美); Supplier Footprint: DO-41; JLCPCB Part Class: 扩展库; Datasheet: https://atta.szlcsc.com/upload/public/pdf/source/20190903/C415645_372B950460B1CEF9DFFEC50CA36CF291.pdf; Supplier: LCSC; Forward Voltage (Vf@If): 930mV@1A; Reverse Voltage (Vr): 1kV; Rectified Current: 1A; Reverse Leakage Current: 50nA@1kV
Q4 Q6 Q10 Q11 = MMS8050-H-TP: 晶体管类型:NPN;集电极电流(Ic):500mA;集射极击穿电压(Vceo):25V;耗散功率(Pd):300mW;直流电流增益(hFE):120@50mA,1V;; Supplier Part: C668971; Manufacturer: MCC(美微科); Supplier Footprint: SOT-23; JLCPCB Part Class: 扩展库; Datasheet: https://atta.szlcsc.com/upload/public/pdf/source/20200618/C668971_E8C4278A0C61D2294D468F2197C24659.pdf; Supplier: LCSC; type: NPN; Current - Collector(Ic): 500mA; Collector - Emitter Voltage VCEO: 25V; Pd - Power Dissipation: 300mW; DC Current Gain: 120@50mA,1V; Transition frequency(fT): 150MHz; Current - Collector Cutoff: 100nA; Vce Saturation(VCE(sat)): 600mV; Operating Temperature: -55℃~+150℃@(Tj)
R21-R23 = 0603WAF4700T5E: 电阻类型:厚膜电阻;阻值:470Ω;精度:±1%;功率:100mW;最大工作电压:75V;温度系数:±100ppm/℃;; LCSC Part Name: 470Ω ±1% 100mW 厚膜电阻; Supplier Part: C23179; Manufacturer: UNI-ROYAL(厚声); Supplier Footprint: 0603; JLCPCB Part Class: 基础库; Datasheet: https://atta.szlcsc.com/upload/public/pdf/source/20200306/C422600_1E6D84923E4A46A82E41ADD87F860B5C.pdf; Supplier: LCSC; Type: 厚膜电阻; Tolerance: ±1%; Power(Watts): 100mW; Overload Voltage (Max): 75V; Temperature Coefficient: ±100ppm/℃; Operating Temperature Range: -55℃~+155℃
U5 = ESP32-WROOM-32E-N4: ESP32-WROOM-32E 集成 ESP32-D0WD-V3 芯片，具有高的稳定性和安全性能。; LCSC Part Name: 通用型Wi-Fi+BT+BLE MCU模组; Supplier Part: C701341; Manufacturer: ESPRESSIF(乐鑫); Supplier Footprint: SMD,18x25.5mm; JLCPCB Part Class: 扩展库; Datasheet: https://atta.szlcsc.com/upload/public/pdf/source/20220601/0020821B65DE5740BBACA5FACC5CF3B6.pdf; Supplier: LCSC
U15 = CH340C: 应用功能:收发器;接口协议:USB 2.0;数据速率:2Mbps;; LCSC Part Name: CH340C USB转串口芯片 CH340; Supplier Part: C84681; Manufacturer: WCH(南京沁恒); Supplier Footprint: SOP-16; JLCPCB Part Class: 扩展库; Datasheet: https://atta.szlcsc.com/upload/public/pdf/source/20240619/63986D8440D4E5267A77ACD891CC4DE3.pdf; Supplier: LCSC; Applications Function: 收发器; Protocol: USB 2.0; Supply Voltage: 3.3V；5V; Data Rate: 2Mbps

## Nets
3.3V: C31.2 C33.2 C52.1 Q6.3(C) R23.1 U5.2(3V3) U15.16(VCC) U19.2(VOUT(TAB)) U19.4(TAB)
+5V: Q4.3(C)
GND: C12.1 C31.1 C32.1 C33.1 C45.1 C46.1 C47.1 C48.1 C49.1 C50.1 C50.2 C51.1 C52.2 C53.1 D4.2 L5.2 LED16.1(K) R35.1 R36.1 R46.1 R47.1 R54.2 SW6.2 U5.1(GND) U5.38(GND) U5.39(GND) U15.1(GND) U18.6(BAT) U18.9(EP) U19.1(ADJ(GND)) USB2.1(GND) USB2.12(GND) USB2.13(SHELL) USB2.14(SHELL) USB3.1(GND) USB3.12(GND) USB3.13(SHELL) USB3.14(SHELL)
VBUS: USB3.2(VBUS) USB3.11(VBUS)
CH340_D+: USB2.6(DP1) USB2.8(DP2)
CH340_D-: USB2.5(DN2) USB2.7(DN1)
Net-(C12-2): C12.2 D4.1 Q4.2(E)
Net-(C32-2): C32.2 U15.4(V3)
Net-(C45-2): C45.2 R53.1
Net-(C46-2): C46.2 R53.2 U18.1(VIN) USB2.2(VBUS) USB2.11(VBUS)
Net-(C47-2): C47.2 C48.2 C49.2 C53.2 U18.8(VOUT) U19.3(VIN)
Net-(C51-2): C51.2 R54.1
Net-(L5-1): L5.1 U18.7(SW)
Net-(LED12-1): LED12.1(K) LED13.2(+) LED14.1(K) LED15.2(A) U18.4(LED3)
Net-(LED12-2): LED12.2(A) LED13.1(-) U18.2(LED1)
Net-(LED14-2): LED14.2(A) LED15.1(K) U18.3(LED2)
Net-(LED16-2): LED16.2(A) R56.1
Net-(Q4-1): Q4.1(B) R24.2
Net-(Q6-1): Q6.1(B) R26.2
Net-(Q10-1): Q10.1(B) R44.1
Net-(Q10-2): Q10.2(E) R45.2 U15.14(RTS#)
Net-(Q10-3): Q10.3(C) U5.3(EN)
Net-(Q11-1): Q11.1(B) R45.1
Net-(Q11-2): Q11.2(E) R44.2 U15.13(DTR#)
Net-(R21-1): R21.1 U5.34(RXD0)
Net-(R21-2): R21.2 U15.2(TXD)
Net-(R22-1): R22.1 U5.35(TXD0)
Net-(R22-2): R22.2 U15.3(RXD)
Net-(R23-2): R23.2 SW4.2
Net-(R24-1): R24.1 U5.10(IO25)
Net-(R26-1): R26.1 U5.11(IO26)
Net-(R35-2): R35.2 USB2.4(CC1)
Net-(R36-2): R36.2 USB2.10(CC2)
Net-(R46-2): R46.2 USB3.4(CC1)
Net-(R47-2): R47.2 USB3.10(CC2)
Net-(R55-1): R55.1 R56.2 U18.5(KEY)
Net-(R55-2): R55.2 SW6.1
Net-(SW4-1): SW4.1 U5.28(IO17)
Net-(U15-5): U15.5(D+) USB3.6(DP1) USB3.8(DP2)
Net-(U15-6): U15.6(D-) USB3.5(DN2) USB3.7(DN1)

Not connected (* = marked no-connect by the designer): Q6 2(E); Q11 3(C); U5 4(SENSOR_VP) 5(SENSOR_VN) 6(IO34) 7(IO35) 8(IO32) 9(IO33) 12(IO27) 13(IO14) 14(IO12) 15(GND) 16(IO13) 17(NC) 18(NC) 19(NC) 20(NC) 21(NC) 22(NC) 23(IO15) 24(IO2) 25(IO0) 26(IO4) 27(IO16) 29(IO5) 30(IO18) 31(IO19) 32(NC) 33(IO21) 36(IO22) 37(IO23); U15 7(NC.)* 8(OUT#)* 9(CTS#)* 10(DSR#)* 11(RI#)* 12(DCD#)* 15(R232)*; USB2 3(SBU2)* 9(SBU1)*; USB3 3(SBU2)* 9(SBU1)

## Notes on the sheets
sheet 1
- 稳压
- 3.3V输出给芯片供电
- 由USB或电池供电，竟电池管理芯片输出后为5V
- 5V输出，由USB供电，
- type c 接口
sheet 2
- type c 接口
- ttl串口

# Board PCB1
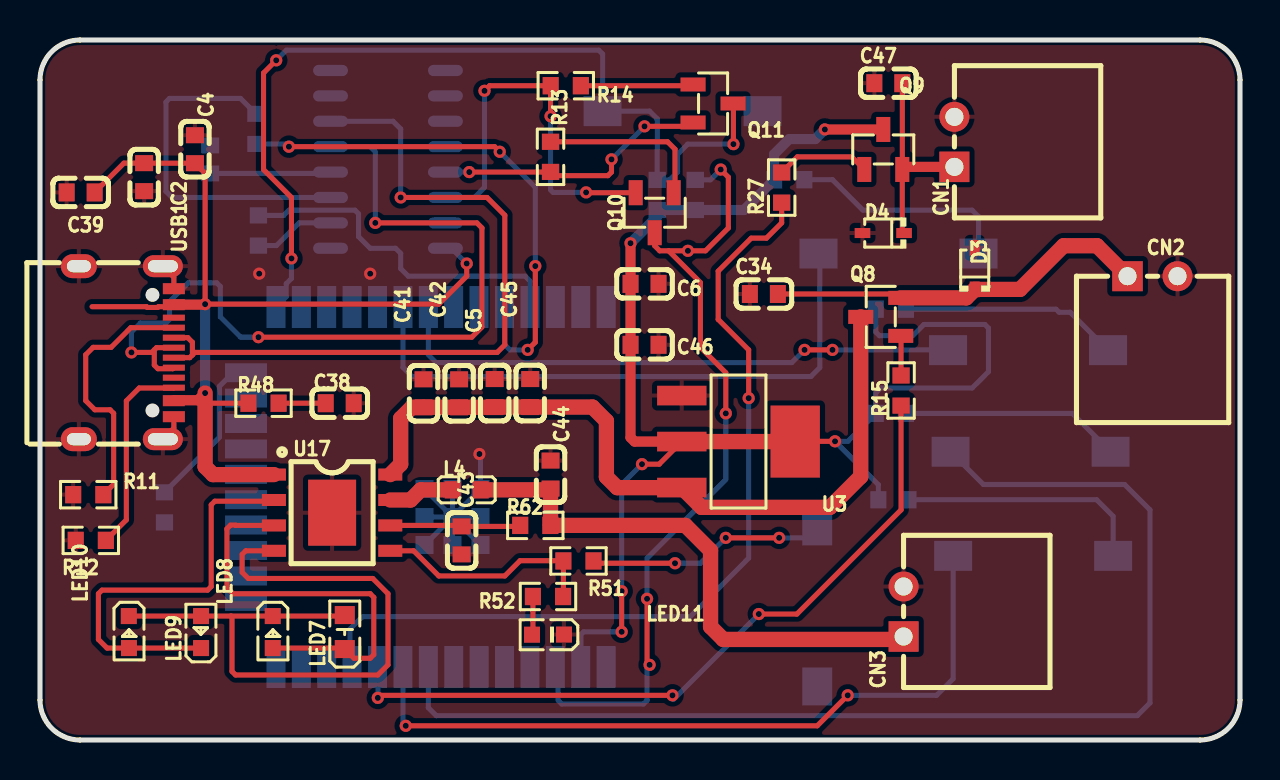
[diagram p4: board, top side]
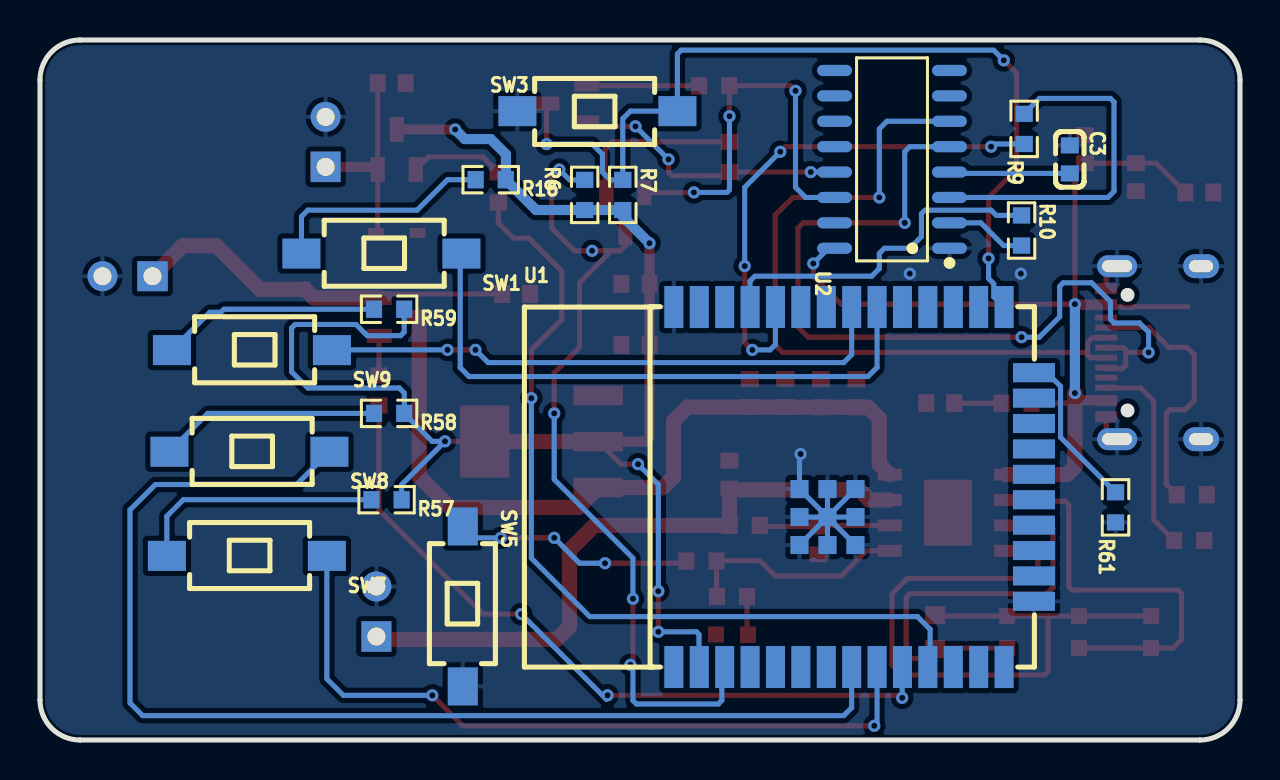
[diagram p5: board, bottom side, seen from below]

Outline 60 x 35 mm; copper layers: Top Layer, Bottom Layer. Coordinates in mm from the lower left corner of the outline.
Outline path: 0,33 0,2 arc(0.59,0.59) 2,0 58,0 arc(59.41,0.59) 60,2 60,33 arc(59.41,34.41) 58,35 2,35 arc(0.59,34.41) 0,33
Stack: Top Layer 0.035mm / Dielectric1 1.51mm FR4 er 4.5 / Bottom Layer 0.035mm

## Design rules (mm)
template: JLCPCB Capability(Two Layers Board)
spacing copperThickness1oz (default): track to track 0.102, other pairs 0.152 to 0.3
spacing copperThickness2oz: track to track 0.203, other pairs 0.152 to 0.3
track width copperThickness1oz (default): min 0.127, default 0.254, max 2.54
track width copperThickness2oz: min 0.203, default 0.254, max 2.54
differential pair differentialPair (default): width min 0.127, default 0.254, max 2.54; gap min 0.152, default 0.152
via viaSize (default): diameter min 0.5, default 0.61, max 10; hole min 0.3, default 0.305, max 6.3

## Placement (name value [footprint] x y rotation side)
C2  100nF  [C0603]  5.21 28.14 90 top
C3  100nF  [C0603]  8.51 29.03 270 bottom
C4  10uF  [C0603]  7.75 29.54 270 top
C5  10uF  [C0603]  22.73 17.35 270 top
C6  10uF  [C0603]  30.23 22.81 0 top
C34  4.7uF  [C0603]  36.19 22.3 0 top
C38  10uF  [C0603]  14.99 16.84 180 top
C39  10uF  [C0603]  2.03 27.38 0 top
C41  22uF  [C0603]  19.18 17.33 270 top
C42  22uF  [C0603]  20.96 17.33 270 top
C43  22uF  [C0603]  21.08 9.98 270 top
C44  22uF  [C0603]  25.53 13.27 270 top
C45  100nF  [C0603]  24.51 17.35 270 top
C46  100nF  [C0603]  30.23 19.76 180 top
C47  4.7uF  [C0603]  42.42 32.84 0 top
CN1  ZX-XH2.54-2PWZ  [CONN-TH_2P-P2.50_ZX-XH2.54-2PWZ]  45.72 29.91 90 top
CN2  ZX-XH2.54-2PWZ  [CONN-TH_2P-P2.50_ZX-XH2.54-2PWZ]  55.63 23.19 0 top
CN3  ZX-XH2.54-2PWZ  [CONN-TH_2P-P2.50_ZX-XH2.54-2PWZ]  43.18 6.42 90 top
D3  B0540WS  [SOD-323_L1.7-W1.3-LS2.5-FD]  46.74 23.57 270 top
D4  B0540WS  [SOD-323_L1.7-W1.3-LS2.5-FD]  42.16 25.35 0 top
L4  1uH  [L0603]  21.34 12.51 0 top
LED7  NCD0603G1  [LED0603-RD_1]  15.24 5.4 90 top
LED8  NCD0603B1  [LED0603-RD]  11.64 5.4 270 top
LED9  NCD0603Y1  [LED0603-RD]  8.05 5.4 90 top
LED10  NCD0603R1  [LED0603-RD_RED]  4.44 5.4 270 top
LED11  XL-1608UGC-04  [LED0603-RD_GREEN]  25.4 5.27 180 top
Q8  SS8050  [SOT-23-3_L2.9-W1.3-P1.90-LS2.4-BR]  42.04 21.16 0 top
Q9  SS8050  [SOT-23-3_L2.9-W1.3-P1.90-LS2.4-BR]  42.16 29.53 270 top
Q10  SS8050  [SOT-23-3_L2.9-W1.3-P1.90-LS2.4-BR]  30.73 26.36 90 top
Q11  SS8050  [SOT-23-3_L2.9-W1.3-P1.90-LS2.4-BR]  33.66 31.83 180 top
R6  10kΩ  [R0603]  32.77 27.25 270 bottom
R7  10kΩ  [R0603]  30.86 27.25 270 bottom
R9  470Ω  [R0603]  10.79 30.55 90 bottom
R10  470Ω  [R0603]  10.92 25.47 270 bottom
R11  5.1kΩ  [R0603]  2.41 12.27 0 top
R12  5.1kΩ  [R0603]  2.54 9.98 0 top
R13  10kΩ  [R0603]  25.53 29.16 270 top
R14  10kΩ  [R0603]  26.29 32.71 180 top
R15  100Ω  [R0603]  43.05 17.47 90 top
R16  470Ω  [R0603]  37.47 28.02 0 bottom
R27  100Ω  [R0603]  37.08 27.62 90 top
R48  2Ω  [R0603]  11.18 16.84 180 top
R51  10K  [R0603]  26.92 8.95 0 top
R52  20Ω  [R0603]  25.4 7.17 0 top
R57  470Ω  [R0603]  42.67 12.01 0 bottom
R58  470Ω  [R0603]  42.54 16.33 0 bottom
R59  470Ω  [R0603]  42.54 21.54 0 bottom
R61  10K  [R0603]  6.22 11.63 90 bottom
R62  0.5Ω  [R0603]  24.76 10.73 0 top
SW1  TS-1101-C-W  [SW-SMD_L6.0-W3.3-LS8.0]  42.93 24.32 0 bottom
SW3  TS-1101-C-W  [SW-SMD_L6.0-W3.3-LS8.0]  32.13 31.44 180 bottom
SW5  TS-1101-C-W  [SW-SMD_L6.0-W3.3-LS8.0]  38.86 6.68 270 bottom
SW7  TS-1101-C-W  [SW-SMD_L6.0-W3.3-LS8.0]  49.66 9.21 0 bottom
SW8  TS-1101-C-W  [SW-SMD_L6.0-W3.3-LS8.0]  49.53 14.41 0 bottom
SW9  TS-1101-C-W  [SW-SMD_L6.0-W3.3-LS8.0]  49.4 19.49 0 bottom
U1  ESP32-WROOM-32E-N4  [WIFI-SMD_ESP32-WROOM-32E]  19.3 12.65 180 bottom
U2  CH340C  [SOP-16_L10.0-W3.9-P1.27-LS6.0-BL]  17.4 29.03 90 bottom
U3  AMS1117-3.3  [SOT-223-4_L6.5-W3.5-P2.30-LS7.0-BR]  34.93 14.92 180 top
U17  IP5306  [ESOP-8_L4.9-W3.9-P1.27-LS6.0-BL-EP]  14.6 11.37 270 top
USB1  TYPE-C 16PIN 2MD(073)  [USB-C-SMD_TYPE-C-6PIN-2MD-073]  4.32 19.37 270 top

## Footprints (pads in the part's own frame, mm; a bottom-side part is the same pattern mirrored in y, then rotated)
C0603
  rect 0.8x0.9 smd: 1(-0.7,0) 2(0.7,0)
CONN-TH_2P-P2.50_ZX-XH2.54-2PWZ
  rect 1.524x1.5 hole 0.9: 1(-1.25,0)
  round 1.5 hole 0.9: 2(1.25,0)
ESOP-8_L4.9-W3.9-P1.27-LS6.0-BL-EP
  rect 0.6x1.2 smd: 1(-1.905,-2.909) 2(-0.635,-2.909) 3(0.635,-2.909) 4(1.905,-2.909) 5(1.905,2.909) 6(0.635,2.909) 7(-0.635,2.909) 8(-1.905,2.909)
  rect 3.3x2.4 smd: 9(0,0)
L0603
  rect 0.8x0.864 smd: 1(-0.7,0) 2(0.7,0)
LED0603-RD
  rect 0.8x0.8 smd: 1(-0.799,0) 2(0.799,0)
LED0603-RD_1
  rect 0.9x1 smd: 1(-0.85,0) 2(0.85,0)
LED0603-RD_GREEN
  rect 0.8x0.8 smd: 1(-0.799,-0.004) 2(0.799,0.004)
LED0603-RD_RED
  rect 0.8x0.8 smd: 1(-0.799,-0.004) 2(0.799,0.004)
R0603
  rect 0.806x0.864 smd: 1(-0.753,0) 2(0.753,0)
SOD-323_L1.7-W1.3-LS2.5-FD
  rect 0.78x0.5 smd: 1(-1.04,0) 2(1.04,0)
SOP-16_L10.0-W3.9-P1.27-LS6.0-BL
  oval 0.56x1.745 smd: 1(-4.445,-2.873) 2(-3.175,-2.873) 3(-1.905,-2.873) 4(-0.635,-2.873) 5(0.635,-2.873) 6(1.905,-2.873) 7(3.175,-2.873) 8(4.445,-2.873) 9(4.445,2.873) 10(3.175,2.873) 11(1.905,2.873) 12(0.635,2.873) 13(-0.635,2.873) 14(-1.905,2.873) 15(-3.175,2.873) 16(-4.445,2.873)
SOT-23-3_L2.9-W1.3-P1.90-LS2.4-BR
  rect 1.25x0.7 smd: 1(1,-0.95) 2(1,0.95) 3(-1,0)
SOT-223-4_L6.5-W3.5-P2.30-LS7.0-BR
  rect 2.47x0.98 smd: 1(2.835,-2.3) 2(2.835,0) 3(2.835,2.3)
  rect 2.47x3.6 smd: 4(-2.835,0)
SW-SMD_L6.0-W3.3-LS8.0
  rect 1.9x1.5 smd: 1(-4,0) 2(4,0)
USB-C-SMD_TYPE-C-6PIN-2MD-073
  rect 0.55x1.1 smd: 1(-3.2,2.375) 2(-2.4,2.375) 11(2.4,2.375) 12(3.2,2.375)
  rect 0.3x1.1 smd: 3(-1.75,2.375) 4(-1.25,2.375) 5(-0.75,2.375) 6(-0.25,2.375) 7(0.25,2.375) 8(0.75,2.375) 9(1.25,2.375) 10(1.75,2.375)
  oval 1.1x2 hole 0.6x1.5: 13(-4.325,1.825) 14(4.325,1.825)
  oval 1.2x1.8 hole 0.6x1.2: 13(-4.325,-2.375) 14(4.325,-2.375)
WIFI-SMD_ESP32-WROOM-32E
  rect 0.95x2.1 smd: 1(-9.002,-9) 2(-7.732,-9) 3(-6.463,-9) 4(-5.192,-9) 5(-3.922,-9) 6(-2.652,-9) 7(-1.383,-9) 8(-0.113,-9) 9(1.157,-9) 10(2.428,-9) 11(3.697,-9) 12(4.968,-9) 13(6.237,-9) 14(7.508,-9) 25(7.508,9) 26(6.237,9) 27(4.968,9) 28(3.697,9) 29(2.428,9) 30(1.157,9) 31(-0.113,9) 32(-1.383,9) 33(-2.652,9) 34(-3.922,9) 35(-5.192,9) 36(-6.463,9) 37(-7.732,9) 38(-9.002,9)
  rect 2.1x0.95 smd: 15(9.002,-5.715) 16(9.002,-4.445) 17(9.002,-3.175) 18(9.002,-1.905) 19(9.002,-0.635) 20(9.002,0.635) 21(9.002,1.905) 22(9.002,3.175) 23(9.002,4.445) 24(9.002,5.715)
  rect 0.9x0.9 smd: 39(-2.721,-2.9) 39(-2.721,-1.5) 39(-2.721,-0.1) 39(-1.321,-2.9) 39(-1.321,-1.5) 39(-1.321,-0.1) 39(0.079,-2.9) 39(0.079,-1.5) 39(0.079,-0.1)

## Nets
As in the schematic.

Pads without a net: U1 4 5 6 7 12 13 14 16 17 18 19 20 21 22 26 27 28 29 32 33 36 37; U2 7 8 9 10 11 12 15; USB1 3 9

## Via types
v1: diameter 0.61, hole 0.305, Top Layer to Bottom Layer, 45 vias

## Routing (per net, layer and track width the routed paths; a pad name or vN(x,y) marks a point on that pad's centre or on a via; arc(x,y) is an arc through that point)
3.3V: length 73.8
  Top Layer w0.254: v1(30.1,13.79) 30.96,13.79 U3.2 ; v1(39.75,14.93) 37.77,14.93 U3.4 ; v1(29.08,7.44) v1(29.08,5.41)
  Top Layer w0.508: U3.2 29.73,14.92 29.53,15.13 C46.2 C6.1 v1(29.53,24.84) ; Q9.3 v1(39.24,30.53)
  Top Layer w0.762: U3.2 U3.4
  Bottom Layer w0.254: R59.1 41.79,20.39 41.97,20.22 43.64,20.22 44.2,20.78 47.24,20.78 47.42,20.6 47.42,18.42 46.61,17.6 42.04,17.6 41.78,17.35 41.78,16.34 R58.1 40.39,14.93 v1(39.75,14.93) 41.92,12.77 R57.1 ; v1(29.08,7.44) 29.08,12.78 v1(30.1,13.79) ; U1.2 27.05,3.66 27.05,5.28 27.18,5.41 v1(29.08,5.41)
  Bottom Layer w0.508: v1(29.53,24.84) 30.86,26.17 R7.2 R6.2 35.2,26.5 R16.1 36.7,28.02 36.7,29.28 37.47,30.05 38.76,30.05 v1(39.24,30.53)
5V: length 38.6
  Top Layer w0.762: U17.8 18.03,13.79 18.03,16.08 18.59,16.63 C41.2 C42.2 22.72,16.63 C5.2 C45.2 27.62,16.65 28.32,15.95 28.32,13.16 28.86,12.62 32.09,12.62 U3.3 33.08,11.63 39.5,11.63 41.04,13.17 Q8.3
GND: length 18
  Top Layer w0.254: USB1.13 6.69,23.14 USB1.1 ; USB1.14 6.69,15.59 USB1.12
  Bottom Layer w0.254: U1.39 U1.39 ; U1.39 U1.39 ; U1.39 U1.39 ; U1.39 U1.39 ; U1.39 U1.39 ; U1.39 20.63,12.55 ; U1.39 U1.39 ; U1.39 U1.39 ; v1(21.97,14.3) 22.03,14.24 22.03,12.55
  vias: v1(10.96,23.32) v1(16.51,23.32)
VBUS: length 49.9
  Top Layer w0.254: v1(21.34,23.82) 21.34,23.19 19.94,21.79 v1(8.25,21.79) 8.25,28.33 C4.2 5.21,28.84 C2.2 4.19,28.84 C39.2 ; 8.25,16.78 8.32,16.84 R48.2 ; 2.61,21.67 5.32,21.67 5.36,21.63 5.88,21.63 5.92,21.67 6.59,21.67 6.69,21.77
  Top Layer w0.508: 6.69,21.77 8.23,21.77 v1(8.25,21.79) ; v1(8.25,17.35) 7.9,16.99 6.71,16.99 USB1.11
  Top Layer w0.762: U17.1 8.65,13.27 8.25,13.66 v1(8.25,17.35)
  Bottom Layer w0.254: v1(21.34,23.82) 20.57,24.59 U2.16
  Bottom Layer w0.508: v1(8.25,21.79) v1(8.25,17.35)
AND: length 28.8
  Top Layer w0.254: v1(38.23,19.51) v1(39.62,19.51)
  Bottom Layer w0.254: v1(39.62,19.51) 45.39,19.51 SW9.1 ; 19.42,21.65 19.42,19.27 19.81,18.87 37.59,18.87 v1(38.23,19.51)
B_DOWN: length 37
  Top Layer w0.254: v1(31.62,2.23) 17.02,2.23 v1(16.89,2.11) ; v1(35.94,6.3) 37.85,6.3 43.05,11.5 R15.1
  Bottom Layer w0.254: v1(31.62,2.23) 31.62,2.11 31.69,2.04 v1(35.94,6.3) ; v1(16.89,2.11) 16.89,3.63 U1.10
B_UP: length 43.5
  Top Layer w0.254: R27.1 37.08,25.86 36.32,25.09 35.56,25.09 33.91,23.44 33.91,21.03 35.43,19.51 v1(35.43,17.09)
  Bottom Layer w0.254: v1(35.43,17.09) 35.43,9.09 32.51,6.17 16.13,6.17 15.49,5.54 15.49,3.76 U1.11
CH340_D+: length 42.7
  Top Layer w0.254: 5.72,19.51 5.72,18.74 5.89,18.56 6.64,18.56 USB1.8 ; 5.72,19.51 5.83,19.62 USB1.6 ; 5.72,19.51 5.59,19.38 v1(4.57,19.38) ; v1(10.92,20.14) 21.59,20.14 22.1,20.65 22.1,25.6 21.84,25.86 v1(16.76,25.86)
  Bottom Layer w0.254: v1(4.57,19.38) 4.57,20.39 5.03,20.85 6.3,20.85 6.48,21.03 6.48,21.92 7.42,22.86 8.84,22.86 9.02,22.68 9.02,21.16 10.03,20.14 v1(10.92,20.14) ; v1(16.76,25.86) 16.76,29.41 16.51,29.67 U2.5
CH340_D-: length 37.6
  Top Layer w0.254: 7.62,19.25 7.62,19.89 7.39,20.12 USB1.5 ; 7.62,19.25 7.75,19.38 22.86,19.38 23.24,19.76 23.24,26.24 22.35,27.13 v1(18.03,27.13) ; 7.62,19.25 7.48,19.12 USB1.7
  Bottom Layer w0.254: v1(18.03,27.13) 18.03,30.55 17.65,30.94 U2.6
DOWN: length 59.4
  Bottom Layer w0.254: U1.8 19.42,1.61 19.81,1.22 54.86,1.22 55.5,1.85 55.5,11.5 54.23,12.78 47.17,12.78 SW8.1
DTR: length 13.9
  Top Layer w0.254: Q11.2 32.46,30.68 v1(30.23,30.68) ; v1(21.46,28.4) 25.52,28.4 R13.2 25.72,28.22 28.4,28.22 28.57,28.4 v1(28.57,29.03)
  Bottom Layer w0.254: v1(21.46,28.4) U2.13 ; v1(30.23,30.68) v1(28.57,29.03)
EN: length 41.2
  Top Layer w0.254: v1(30.48,3.76) 30.35,3.89 v1(30.35,7.06) ; 31.43,24.46 33.02,22.87 33.02,19.63 34.29,18.36 v1(34.29,16.33) ; 31.43,24.46 v1(32.4,24.46) 33.27,24.46 34.42,25.6 34.42,28.14 v1(34.04,28.52) ; 31.43,24.46 30.99,24.46 30.73,24.71 Q10.3
  Bottom Layer w0.254: v1(30.35,7.06) 30.35,9.09 34.29,13.03 v1(34.29,16.33) ; v1(34.04,28.52) 33.52,28.01 R6.1 ; U1.3 25.91,3.51 25.91,1.98 26.09,1.8 30.17,1.8 30.35,1.98 30.35,3.63 v1(30.48,3.76)
IO0: length 46
  Top Layer w0.254: v1(34.67,29.79) 34.67,31.81 Q11.3 ; v1(12.57,24.08) 12.57,27.13 11.18,28.52 11.18,33.35 v1(11.81,33.98)
  Bottom Layer w0.254: v1(11.81,33.98) 12.32,34.49 27.94,34.49 28.13,34.3 SW3.2 30.48,31.44 30.86,31.06 R7.1 31.49,28.01 31.88,28.4 31.88,29.28 32.38,29.79 v1(34.67,29.79) ; 11.8,21.65 12.31,22.16 12.31,22.81 12.57,23.07 v1(12.57,24.08)
RTS: length 19.9
  Top Layer w0.254: Q10.2 27.32,27.36 v1(27.31,27.38) ; v1(22.22,32.46) 22.48,32.71 R14.2 25.53,32.71 v1(25.53,31.19)
  Bottom Layer w0.254: v1(25.53,31.19) 25.53,27.51 25.65,27.38 v1(27.31,27.38) ; U2.14 21.72,27.13 22.22,27.63 v1(22.22,32.46)
RXD: length 17.7
  Bottom Layer w0.254: U2.3 6.6,27.13 6.3,27.43 6.3,31.9 6.48,32.08 10.02,32.08 R9.2
STOP: length 30
  Bottom Layer w0.254: 18.15,21.65 18.15,18.63 18.61,18.17 38.54,18.17 38.99,18.62 38.99,24.26 SW1.1
TXD: length 4.1
  Bottom Layer w0.254: U2.2 12.95,25.86 11.82,24.72 R10.2
UP: length 37.5
  Top Layer w0.254: v1(18.29,0.71) 38.86,0.71 v1(40.39,2.23)
  Bottom Layer w0.254: U1.9 18.15,0.85 v1(18.29,0.71) ; v1(40.39,2.23) 44.83,2.23 45.66,3.06 SW7.1
$1N2030: length 17.6
  Bottom Layer w0.254: R10.1 12.18,26.23 12.45,26.49 15.75,26.49 15.93,26.31 15.93,25.17 16.51,24.59 17.78,24.59 18.03,24.33 18.03,23.57 18.41,23.19 24.26,23.19 24.5,22.95 24.5,21.65
$1N2036: length 26.3
  Top Layer w0.254: v1(24.38,19.51) 24.76,19.89 v1(24.76,23.7) ; v1(12.45,29.67) 22.73,29.67 v1(22.99,29.41)
  Bottom Layer w0.254: v1(22.99,29.41) 24.76,27.63 v1(24.76,23.7) ; R9.1 12.31,29.8 v1(12.45,29.67) ; v1(24.38,19.51) 23.5,19.51 23.23,19.77 23.23,21.65
$1N2231: length 6
  Bottom Layer w0.254: U2.4 14.46,28.33 C3.2
$1N2993: length 13.2
  Top Layer w0.254: USB1.4 4.54,20.62 3.56,19.63 2.66,19.63 2.29,19.26 2.29,16.97 2.74,16.51 3.5,16.51 3.68,16.33 3.68,12.78 R11.2
$1N3161: length 10
  Top Layer w0.254: R12.2 4.32,11.01 4.32,16.96 4.96,17.6 6.68,17.6 USB1.10
$1N3457: length 8.6
  Top Layer w0.254: Q10.1 31.75,27.43 31.75,29.54 31.38,29.91 R13.1
$1N3461: length 5.6
  Top Layer w0.254: R14.1 32.59,32.71 Q11.1
$1N3836: length 2
  Top Layer w0.254: R15.2 43.05,20.19 Q8.1
$1N4056: length 11.3
  Bottom Layer w0.254: SW1.2 46.93,26.17 46.61,26.49 41.15,26.49 39.62,28.02 R16.2
$1N5469: length 4.7
  Top Layer w0.254: R27.2 37.87,29.16 40.58,29.16 Q9.1
$1N5472: length 10.2
  Top Layer w0.254: C47.2 43.12,28.53 ; D4.2 43.11,25.44 Q9.2
  Top Layer w0.508: Q9.2 43.25,28.66 CN1.1
$1N8409: length 12.6
  Bottom Layer w0.254: R57.2 52.83,12.01 53.66,11.19 SW7.2
$1N8413: length 11
  Bottom Layer w0.254: SW8.2 51.61,16.33 R58.2
$1N8417: length 11
  Bottom Layer w0.254: R59.2 50.81,21.54 50.96,21.39 51.51,21.39 SW9.2
$1N8861: length 8
  Bottom Layer w0.254: R61.2 8.97,15.14 8.97,17.68 9.65,18.36 U1.24
$1N9302: length 19.3
  Top Layer w0.254: C34.2 42.84,22.3 Q8.2
  Top Layer w0.762: CN2.1 52.85,24.71 51.18,24.71 49,22.53 D3.2 46.31,22.11 Q8.2
$2N7089: length 2.4
  Top Layer w0.254: C38.2 R48.1
$2N7648: length 3.3
  Top Layer w0.762: L4.1 19.04,12.51 18.53,12 U17.7
$2N7999: length 11.3
  Top Layer w0.254: R52.2 26.17,7.19 R51.1 26.16,8.97 24,8.97 23.24,8.2 19.94,8.2 18.68,9.46 U17.5
$2N8119: length 12
  Top Layer w0.254: v1(36.96,10.11) v1(34.29,10.11) ; v1(31.75,8.84) 27.79,8.84 R51.2
  Bottom Layer w0.254: v1(34.29,10.11) 33.02,8.84 v1(31.75,8.84) ; SW5.1 38.29,10.11 v1(36.96,10.11)
$2N8284: length 1.9
  Top Layer w0.254: R52.1 24.65,5.31 LED11.2
$2N8838: length 6.5
  Top Layer w0.254: U17.6 21.03,10.73 C43.1 23.96,10.68 R62.1
$2N8868: length 27.7
  Top Layer w0.762: CN3.1 43.03,5.03 34.16,5.03 33.53,5.66 33.53,9.47 32.27,10.73 R62.2 25.53,10.74 C44.2 25.47,12.51 L4.2
$2N9076: length 35.5
  Top Layer w0.254: 9.55,6.2 9.6,6.15 9.6,3.43 9.78,3.25 16.89,3.25 17.4,3.76 17.4,7.31 16.64,8.08 10.41,8.08 10.11,8.38 10.11,9.28 10.29,9.46 U17.4 ; 9.55,6.2 LED8.1 15.19,6.2 LED7.2 ; 9.55,6.2 LED9.2 LED10.1
$2N9082: length 21.1
  Top Layer w0.254: 11.64,4.6 15.19,4.6 15.7,4.09 16.51,4.09 16.69,4.27 16.69,7.13 16.51,7.31 9.65,7.31 9.35,7.62 9.35,10.56 9.53,10.74 9.78,10.74 9.79,10.73 U17.3
$2N9123: length 20.7
  Top Layer w0.254: LED9.1 LED10.2 3.35,4.6 2.92,5.03 2.92,7.31 3.1,7.49 8.38,7.49 8.56,7.67 8.56,11.76 8.74,11.94 11.63,11.94 U17.2

## Copper pours and planes (outline as drawn; the poured copper is in the pictures)
GND on Top Layer: -3.68,37.03 64.77,37.03 64.77,-2.97 -3.68,-2.97
GND on Bottom Layer: -5.72,38.81 66.8,38.81 66.8,-4.62 -5.72,-4.62
